# Altium project BMS_Slave.PrjPcb
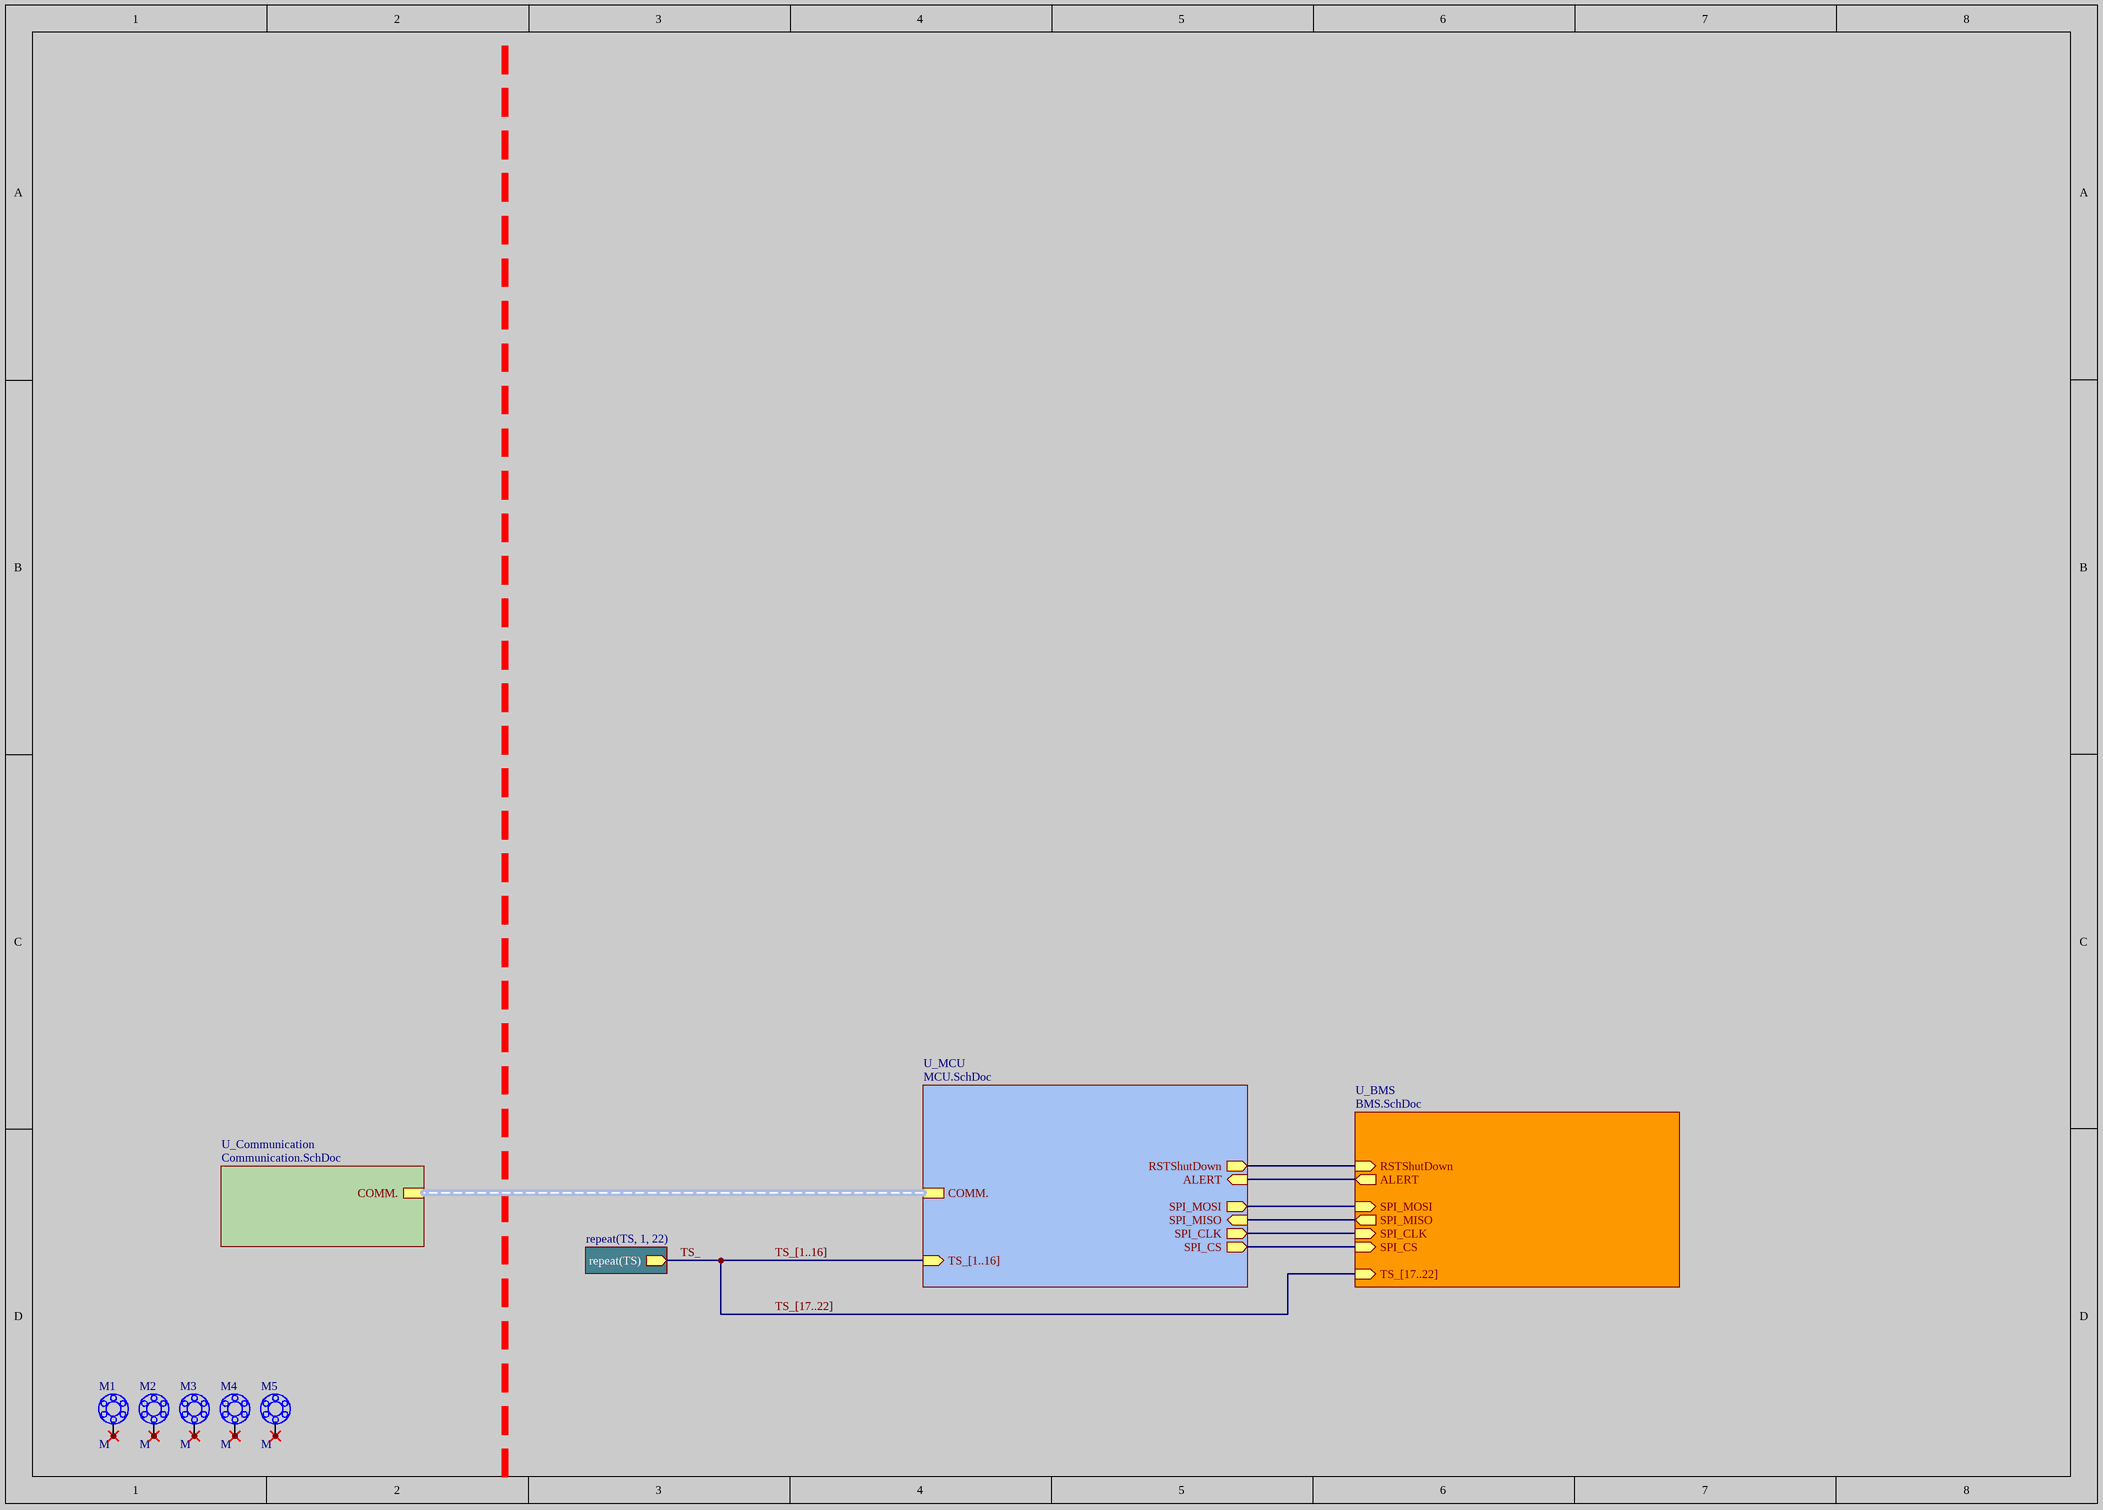
[diagram p0: MotherSheet.SchDoc]
6 sheets, 344 parts. Net scope: hierarchical (ports join the sheet entries above them; power ports are global).
Board file: BMS_Slavee.PcbDoc
Sheets:
  MotherSheet.SchDoc
    U_MCU = MCU.SchDoc
    U_Communication = Communication.SchDoc
    U_BMS = BMS.SchDoc
      balancer1 = balancer.SchDoc
      balancer2 = balancer.SchDoc
      balancer3 = balancer.SchDoc
      balancer4 = balancer.SchDoc
      balancer5 = balancer.SchDoc
      balancer6 = balancer.SchDoc
      balancer7 = balancer.SchDoc
      balancer8 = balancer.SchDoc
      balancer9 = balancer.SchDoc
      balancer10 = balancer.SchDoc
      balancer11 = balancer.SchDoc
      balancer12 = balancer.SchDoc
      balancer13 = balancer.SchDoc
      balancer14 = balancer.SchDoc
      balancer15 = balancer.SchDoc
      balancer16 = balancer.SchDoc
    TS1 = Temperature Sensors.SchDoc
    TS2 = Temperature Sensors.SchDoc
    TS3 = Temperature Sensors.SchDoc
    TS4 = Temperature Sensors.SchDoc
    TS5 = Temperature Sensors.SchDoc
    TS6 = Temperature Sensors.SchDoc
    TS7 = Temperature Sensors.SchDoc
    TS8 = Temperature Sensors.SchDoc
    TS9 = Temperature Sensors.SchDoc
    TS10 = Temperature Sensors.SchDoc
    TS11 = Temperature Sensors.SchDoc
    TS12 = Temperature Sensors.SchDoc
    TS13 = Temperature Sensors.SchDoc
    TS14 = Temperature Sensors.SchDoc
    TS15 = Temperature Sensors.SchDoc
    TS16 = Temperature Sensors.SchDoc
    TS17 = Temperature Sensors.SchDoc
    TS18 = Temperature Sensors.SchDoc
    TS19 = Temperature Sensors.SchDoc
    TS20 = Temperature Sensors.SchDoc
    TS21 = Temperature Sensors.SchDoc
    TS22 = Temperature Sensors.SchDoc

## Sheet MotherSheet.SchDoc
size A3; SheetNumber: 1; SheetTotal: 6

### Parts
M1  M  [MOUNTING]  (no BOM)
M2  M  [MOUNTING]  (no BOM)
M3  M  [MOUNTING]  (no BOM)
M4  M  [MOUNTING]  (no BOM)
M5  M  [MOUNTING]  (no BOM)

### Sub-sheets
repeat(TS, 1, 22) = Temperature Sensors.SchDoc: repeat(TS) (out)
U_BMS = BMS.SchDoc: RSTShutDown (in), SPI_CS (in), SPI_MOSI (in), SPI_MISO (out), SPI_CLK (in), ALERT (out), TS_[17..22] (in)
U_Communication = Communication.SchDoc: COMM. (harness COMM.)
U_MCU = MCU.SchDoc: COMM. (harness COMM.), SPI_CS (out), SPI_MOSI (out), SPI_MISO (in), SPI_CLK (out), ALERT (in), RSTShutDown (out), TS_[1..16] (in)

### Nets
TS_: sheet repeat(TS, 1, 22)/repeat(TS)
NetM1_1: M1.1 M1.2 M1.3 M1.4 M1.5 M1.6 M1.7
NetM2_1: M2.1 M2.2 M2.3 M2.4 M2.5 M2.6 M2.7
NetM3_1: M3.1 M3.2 M3.3 M3.4 M3.5 M3.6 M3.7
NetM4_1: M4.1 M4.2 M4.3 M4.4 M4.5 M4.6 M4.7
NetM5_1: M5.1 M5.2 M5.3 M5.4 M5.5 M5.6 M5.7
NetPB1_1: sheet U_MCU/RSTShutDown, sheet U_BMS/RSTShutDown
NetR9_2: sheet U_MCU/SPI_MISO, sheet U_BMS/SPI_MISO
NetR10_2: sheet U_MCU/SPI_CLK, sheet U_BMS/SPI_CLK
NetU1_28: sheet U_MCU/ALERT, sheet U_BMS/ALERT
NetU1_57: sheet U_MCU/SPI_MOSI, sheet U_BMS/SPI_MOSI
NetU1_61: sheet U_MCU/SPI_CS, sheet U_BMS/SPI_CS

### Buses and harness runs
bus TS_[1..16] = sheet U_MCU/TS_[1..16]
bus TS_[17..22] = sheet U_BMS/TS_[17..22]
harness sheet U_Communication/COMM. = sheet U_MCU/COMM.

### Library data of the parts
M1-M5 = MOUNTING

## Sheet MCU.SchDoc
size A3; SheetNumber: 3; SheetTotal: 6
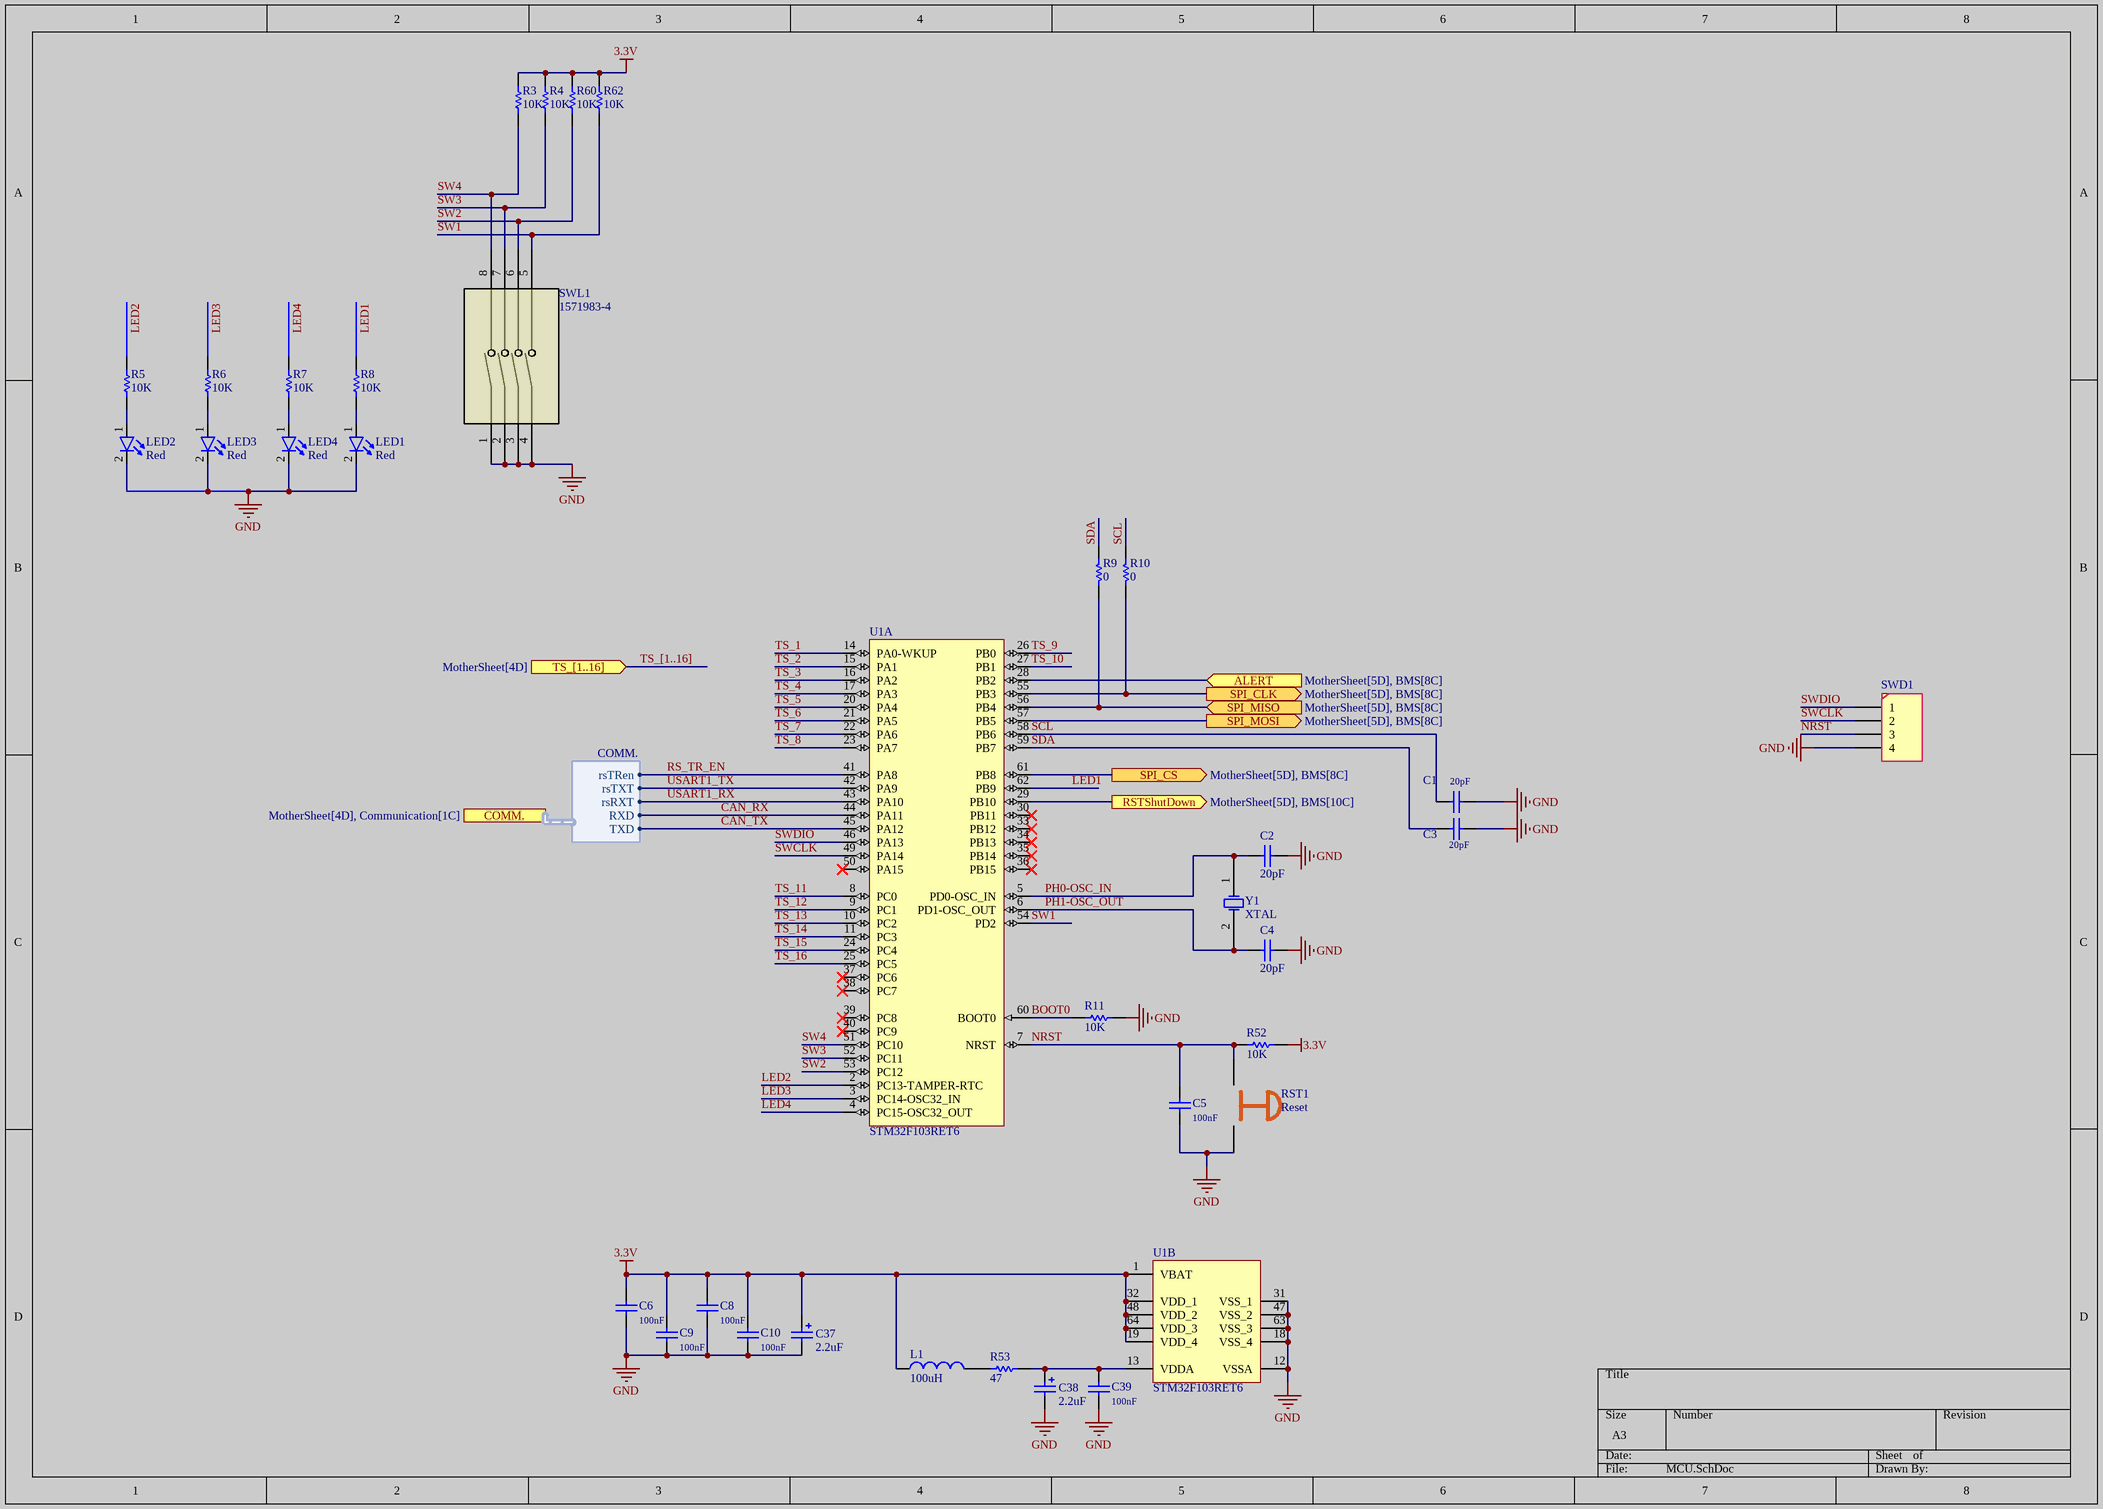
[diagram p1: MCU.SchDoc]

### Parts
C1  20pF  [CAPC0603]
C2  20pF  [CAPC0603]
C3  20pF  [CAPC0603]
C4  20pF  [CAPC0603]
C5  100nF  [CAPC0603]
C6  100nF  [CAPC0603]
C8  100nF  [CAPC0603]
C9  100nF  [CAPC0603]
C10  100nF  [CAPC0603]
C37  2.2uF  [CAP1206]
C38  2.2uF  [CAP1206]
C39  100nF  [CAPC0603]
L1  100uH  [RES1206]
LED1  Red  [LED]
LED2  Red  [LED]
LED3  Red  [LED]
LED4  Red  [LED]
R3  10K  [RES0603]
R4  10K  [RES0603]
R5  10K  [RESC0603]
R6  10K  [RESC0603]
R7  10K  [RESC0603]
R8  10K  [RESC0603]
R9  0  [RESC0603]
R10  0  [RESC0603]
R11  10K  [RESC0603]
R52  10K  [RESC0603]
R53  47  [RESC0603]
R60  10K  [RES0603]
R62  10K  [RES0603]
RST1  Reset  [SWITCH-PB4]
SWD1  (no value)  [PIN HEADER 1*4 MALE]
SWL1  1571983-4  [SW4_1571983_4P_TEC]
U1  STM32F103RET6  [LQFP, 64]  (parts A,B of 2)
Y1  XTAL  [XTAL]

### Ports
ALERT (in, see MotherSheet[5D], BMS[8C]), COMM. (harness COMM., see MotherSheet[4D], Communication[1C]), RSTShutDown (out, see MotherSheet[5D], BMS[10C]), SPI_CLK (out, see MotherSheet[5D], BMS[8C]), SPI_CS (out, see MotherSheet[5D], BMS[8C]), SPI_MISO (in, see MotherSheet[5D], BMS[8C]), SPI_MOSI (out, see MotherSheet[5D], BMS[8C]), TS_[1..16] (in, see MotherSheet[4D])

### Harnesses
COMM.: RXD, TXD, rsRXT, rsTXT, rsTRen

### Nets
3.3V: C6.1 C8.1 C9.1 C10.1 C37.1 L1.1 R3.2 R4.2 R52.2 R60.2 R62.2 U1.1(VBAT) U1.19(VDD_4) U1.32(VDD_1) U1.48(VDD_2) U1.64(VDD_3)
GND: C1.2 C2.1 C3.2 C4.1 C5.2 C6.2 C8.2 C9.2 C10.2 C37.2 C38.2 C39.2 LED1.2(K) LED2.2(K) LED3.2(K) LED4.2(K) R11.1 RST1.2 SWD1.4 SWL1.1 SWL1.2 SWL1.3 SWL1.4 U1.12(VSSA) U1.18(VSS_4) U1.31(VSS_1) U1.47(VSS_2) U1.63(VSS_3)
BOOT0: R11.2 U1.60(BOOT0)
CAN_RX: U1.44(PA11) ; port COMM..RXD
CAN_TX: U1.45(PA12) ; port COMM..TXD
LED1: R8.2 U1.62(PB9)
LED2: R5.2 U1.2(PC13-TAMPER-RTC)
LED3: R6.2 U1.3(PC14-OSC32_IN)
LED4: R7.2 U1.4(PC15-OSC32_OUT)
NRST: C5.1 R52.1 RST1.1 SWD1.3 U1.7(NRST)
PH0-OSC_IN: C2.2 U1.5(PD0-OSC_IN) Y1.1
PH1-OSC_OUT: C4.2 U1.6(PD1-OSC_OUT) Y1.2
RS_TR_EN: U1.41(PA8) ; port COMM..rsTRen
SCL: C1.1 R10.1 U1.58(PB6)
SDA: C3.1 R9.1 U1.59(PB7)
SW1: R62.1 SWL1.5 U1.54(PD2)
SW2: R60.1 SWL1.6 U1.53(PC12)
SW3: R4.1 SWL1.7 U1.52(PC11)
SW4: R3.1 SWL1.8 U1.51(PC10)
SWCLK: SWD1.2 U1.49(PA14)
SWDIO: SWD1.1 U1.46(PA13)
TS_1: U1.14(PA0-WKUP)
TS_2: U1.15(PA1)
TS_3: U1.16(PA2)
TS_4: U1.17(PA3)
TS_5: U1.20(PA4)
TS_6: U1.21(PA5)
TS_7: U1.22(PA6)
TS_8: U1.23(PA7)
TS_9: U1.26(PB0)
TS_10: U1.27(PB1)
TS_11: U1.8(PC0)
TS_12: U1.9(PC1)
TS_13: U1.10(PC2)
TS_14: U1.11(PC3)
TS_15: U1.24(PC4)
TS_16: U1.25(PC5)
USART1_RX: U1.43(PA10) ; port COMM..rsRXT
USART1_TX: U1.42(PA9) ; port COMM..rsTXT
NetC38_1: C38.1 C39.1 R53.1 U1.13(VDDA)
NetL1_2: L1.2 R53.2
NetLED1_1: LED1.1(A) R8.1
NetLED2_1: LED2.1(A) R5.1
NetLED3_1: LED3.1(A) R6.1
NetLED4_1: LED4.1(A) R7.1
NetPB1_1: U1.29(PB10) ; port RSTShutDown
NetR9_2: R9.2 U1.56(PB4) ; port SPI_MISO
NetR10_2: R10.2 U1.55(PB3) ; port SPI_CLK
NetU1_28: U1.28(PB2) ; port ALERT
NetU1_57: U1.57(PB5) ; port SPI_MOSI
NetU1_61: U1.61(PB8) ; port SPI_CS

Not connected (* = marked no-connect by the designer): U1 30(PB11)* 33(PB12)* 34(PB13)* 35(PB14)* 36(PB15)* 37(PC6)* 38(PC7)* 39(PC8)* 40(PC9)* 50(PA15)*

### Buses and harness runs
bus TS_[1..16] = port TS_[1..16]

### Library data of the parts
C1-C6 C8-C10 C39 = Capacitor: Published: 8-Jun-2000; LatestRevisionDate: 17-Jul-2002; LatestRevisionNote: Re-released for DXP Platform.; PackageReference: C0805; Publisher: Altium Limited
  C1-C4: Value: 20pF
  C5 C6 C8-C10 C39: Value: 100nF
C37 C38 = Cap_Tan: Tantalium Capacitor Size C; Published: 8-Jun-2000; LatestRevisionDate: 17-Jul-2002; LatestRevisionNote: Re-released for DXP Platform.; PackageReference: C0805; Publisher: Altium Limited
L1 = INDUCTOR: Value: 68uH; Code_IEC: 1005; Published: 8-Jun-2000; Publisher: Altium Limited; LatestRevisionDate: 17-Jul-2002; LatestRevisionNote: Re-released for DXP Platform.; PackageReference: 0402-A; Code_JEITA: 0402
LED1-LED4 = LED: Designer: Saeid Jorablo; Organazation: ControTec; Adding Date: 1387/12/22; Color: Red; Size: SMD 0603
R3-R11 R52 R53 R60 R62 = Resistor: 0603,0.1W; Published: 8-Jun-2000; LatestRevisionDate: 17-Jul-2002; LatestRevisionNote: Re-released for DXP Platform.; PackageReference: AXIAL-0.5; Publisher: Altium Limited
  R3-R8 R11 R52 R60 R62: Value: 10K
  R9 R10: Value: 0
  R53: Value: 47
RST1 = Swtich-PB4: 4-Pin Push Button
SWD1 = Header1*4: Header, 4-Pin
SWL1 = 1571983-4: GDH04S04=DIP SWITCH; Manufacturer_Name: TE Connectivity; Copyright: Copyright (C) 2025 Ultra Librarian. All rights reserved.; Manufacturer_Part_Number: 1571983-4; RefDes: RefDes; Type: Type
U1 = STM32F103RET6: ARM Cortex-M3 32-bit MCU, 512 KB Flash, 64 KB Internal RAM, 51 I/Os, 64-pin LQFP, -40 to 85 degC, Tray; A/D Converter: 3x12-bit (16 Channel); D/A Converter: 2x12-bit (2 Channel); FLASH Size (Prog) (kB): 512; I/Os (High Current): 51; Internal RAM Size (kB): 64; Operating Frequency(F) (Processor speed) (MHz): 72; Supply Voltage(Vcc) min (V): 2; DatasheetVersion: Rev. 8; PackageVersion: Rev. 4, 06/2013; PackageReference: LQFP64; PackageDescription: 64-Pin Low Profile Quad Flat Package, 10 x 10 mm Body, 0.5 mm Pitch; Supplier 1: Digi-Key; Supplier Part Number 1: 497-6444-ND; Supplier 2: Farnell; Supplier Part Number 2: 1624138; Supplier 3: Newark; Supplier Part Number 3: 01P4101; Supplier 4: Newark; Supplier Part Number 4: 57P1231; Supplier 5: Mouser; Supplier Part Number 5: 511-STM32F103RET6; Core: ARM Cortex-M3; Packing: Tray; Mounting Technology: Surface Mount; PartNumber: STM32F103RET6; ComponentLink1Description: Manufacturer URL; ComponentLink1URL: http://www.st.com/web/en/home.html; ComponentLink2Description: Datasheet; ComponentLink2URL: http://www.st.com/st-web-ui/static/active/en/resource/technical/document/datasheet/CD00191185.pdf; ComponentLink3Description: Package Specification; ComponentLink3URL: http://www.st.com/st-web-ui/static/active/en/resource/technical/document/datasheet/DM00037051.pdf

## Sheet Communication.SchDoc
size A3; SheetNumber: 2; SheetTotal: 6
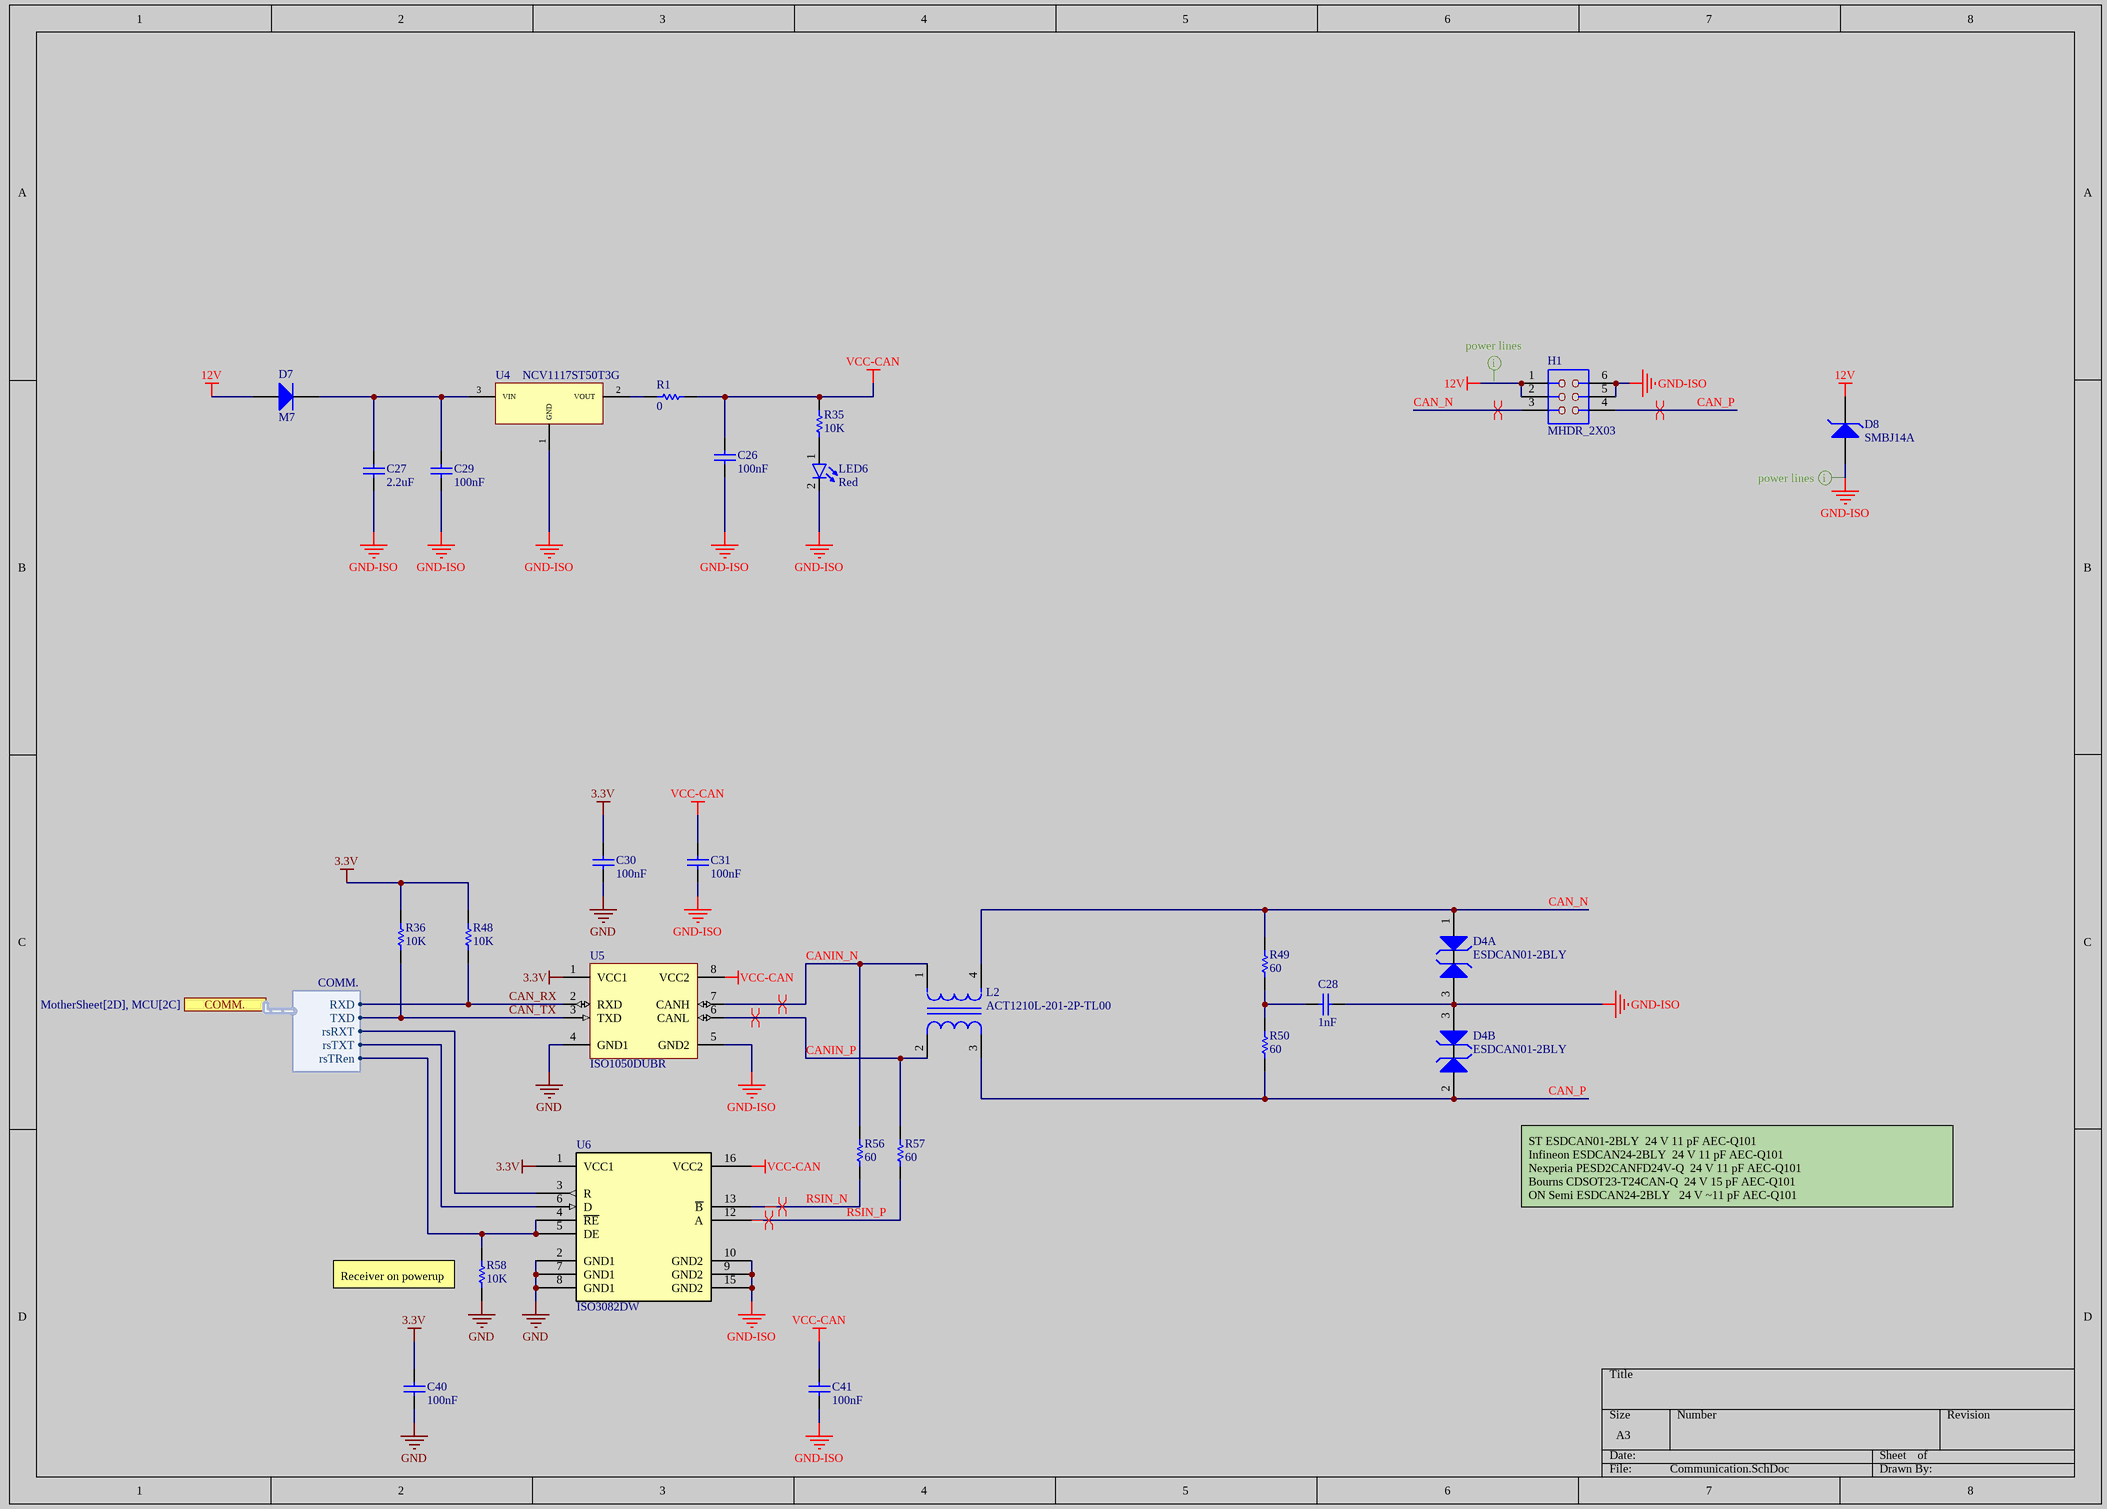
[diagram p2: Communication.SchDoc]

### Parts
C26  100nF  [CAPC0603]
C27  2.2uF  [cap1206]
C28  1nF  [CAP0603]
C29  100nF  [CAPC0603]
C30  100nF  [CAPC0603]
C31  100nF  [CAPC0603]
C40  100nF  [CAPC0603]
C41  100nF  [CAPC0603]
D4  ESDCAN01-2BLY  [NPN]  (parts A,B of 2)
D7  M7  [SS36]
D8  SMBJ14A  [SMBJSeries_LTF-M]
H1  MHDR_2X03  [miniATX 2 × 3]
L2  ACT1210L-201-2P-TL00  [FP-ACT1210L-MFG]
LED6  Red  [led]
R1  0  [RES0603]
R35  10K  [RES0603]
R36  10K  [RES0603]
R48  10K  [RES0603]
R49  60  [RES0603]
R50  60  [RES0603]
R56  60  [RES0603]
R57  60  [RES0603]
R58  10K  [RES0603]
U4  NCV1117ST50T3G  [AMS1117]
U5  ISO1050DUBR  [soic 8]
U6  ISO3082DW  [DW16]

### Ports
COMM. (harness COMM., see MotherSheet[2D], MCU[2C])

### Harnesses
COMM.: RXD, TXD, rsRXT, rsTXT, rsTRen

### Nets
3.3V: C30.2 C40.2 R36.1 R48.1 U5.1(VCC1) U6.1(VCC1)
12V: D7.1(A) D8.1(A) H1.1 H1.2
GND: C30.1 C40.1 R58.2 U5.4(GND1) U6.2(GND1) U6.7(GND1) U6.8(GND1)
GND-ISO: C26.1 C27.1 C28.1 C29.1 C31.1 C41.1 D4.3(A) D8.2(B) H1.5 H1.6 LED6.2(K) U4.1(GND) U5.5(GND2) U6.9(GND2) U6.10(GND2) U6.15(GND2)
VCC-CAN: C26.2 C31.2 C41.2 R1.2 R35.1 U5.8(VCC2) U6.16(VCC2)
CAN_N: D4.1(A) H1.3 L2.4 R49.1
CAN_P: D4.2(A) H1.4 L2.3 R50.1
CAN_RX: R48.2 U5.2(RXD) ; port COMM..RXD
CAN_TX: R36.2 U5.3(TXD) ; port COMM..TXD
CANIN_N: L2.1 R56.2 U5.7(CANH)
CANIN_P: L2.2 R57.1 U5.6(CANL)
RS_TR_EN: R58.1 U6.4(~{RE}) U6.5(DE) ; port COMM..rsTRen
RSIN_N: R56.1 U6.13(~{B})
RSIN_P: R57.2 U6.12(A)
USART1_RX: U6.3(R) ; port COMM..rsRXT
USART1_TX: U6.6(D) ; port COMM..rsTXT
NetC27_2: C27.2 C29.2 D7.2(K) U4.3(VIN)
NetC28_2: C28.2 R49.2 R50.2
NetLED6_1: LED6.1(A) R35.2
NetR1_1: R1.1 U4.2(VOUT)

### Layout directives
differential pair: CAN_N, CAN_P, CANIN_N, CANIN_P, RSIN_N, RSIN_P
rule Width Constraint [Pref Width = 1mm    Min Width = 1mm    Max Width = 1mm]; rule Routing Via Style [Pref Size = 2mm    Pref Hole Size = 1mm]; rule Routing Via Style [Pref Size = 2mm    Pref Hole Size = 1mm]: 12V, GND-ISO

### Notes on the sheet
- ST ESDCAN01-2BLY		24 V	11 pF	AEC-Q101
  Infineon ESDCAN24-2BLY		24 V	11 pF	AEC-Q101
  Nexperia PESD2CANFD24V-Q		24 V	11 pF	AEC-Q101
  Bourns CDSOT23-T24CAN-Q		24 V	15 pF	AEC-Q101
  ON Semi ESDCAN24-2BLY 		24 V	~11 pF	AEC-Q101
- (near R58) Receiver on powerup

### Library data of the parts
C26-C31 C40 C41 = Capacitor: Published: 8-Jun-2000; Publisher: Altium Limited
  C26 C29-C31 C40 C41: LatestRevisionDate: 17-Jul-2002; LatestRevisionNote: Re-released for DXP Platform.; PackageReference: C0805; Value: 100nF
  C27: LatestRevisionDate: 17-Jul-2002; LatestRevisionNote: Re-released for DXP Platform.; PackageReference: C0805; Value: 2.2uF
  C28: LatestRevisionDate: 29-May-2009; LatestRevisionNote: IPC-7351 Footprint Added.; PackageReference: C1206; PackageDescription: Chip Capacitor; Value: 1nF
D4 = TVS: transiebt voltage suppressor
D7 = SS36
D8 = SMBJ14ALK: ESD protection diode / TVS diodes
H1 = HDR_mini_2 × 3: Male Header 2X03
L2 = line filter CMP-08256-000003-1: CMC 200UH 70MA 2LN SMD; Manufacturer: TDK; Test Frequency: 100kHz; Series Resistance: 5.5Ω; Impedance At Frequency: 9.5kΩ @ 10MHz; Tolerance: -10/30%; Automotive Grade: Grade 1; Automotive: Yes; ComponentLink2URL: https://product.tdk.com/info/en/catalog/datasheets/cmf_automotive_signal_act1210l-201_en.pdf; Height: 2.5mm; RoHS: TRUE; Rms Current: 70mA; Temperature Range High: +125°C; Composition: Wirewound; Device Class L1: Passive Components; Device Class L3: Common Mode Chokes; Value: 200uH; Category: Ind; Mouser Description: Ind Common Mode Choke 200uH 9.5KOhm 70mA 5.5Ohm -10% to 30% Wirewound 4-Pin 1210; Device Class L2: EMI / RFI Components; Temperature Range Low: -40°C; Package: ACT1210L; Digikey Description: CMC 200UH 70MA 2LN SMD; Octopart: https://octopart.com/act1210l-201-2p-tl00-tdk-81014617; Manufacturer Part Number: ACT1210L-201-2P-TL00; Lead Free: Yes; Inductance: 200uH; Temperature: -40°C to +125°C; ComponentLink2Description: Datasheet
LED6 = LED: as LED1 on sheet MCU; Adding Date: 1387/12/22; Color: Red; Size: SMD 0603
R1 R35 R36 R48-R50 R56-R58 = Res: Resistor; Published: 8-Jun-2000; LatestRevisionDate: 17-Jul-2002; LatestRevisionNote: Re-released for DXP Platform.; PackageReference: AXIAL-0.3; Publisher: Altium Limited; PackageDescription: Axial Device, Thru-Hole; 2 Leads; 0.3 in Pin Spacing
  R1: Value: 0
  R35 R36 R48 R58: Value: 10K
  R49 R50 R56 R57: Value: 60
U4 = AMS1117: NCP1117ST50T3G LDO 5V
U5 = ISO1050DUBR: Isolated CAN Transceiver, -55 to 105 degC, 8-pin SOP (DUB), Green (RoHS & no Sb/Br); Manufacturer: Texas Instruments; Rating: Catalog; Isolated: Yes; Drivers Per Package: 1; PackageReference: DUB0008A; PartNumber: ISO1050DUBR; ComponentLink2Description: Package Specification; ComponentLink1Description: Datasheet; Mounting Technology: Surface Mount; ComponentLink1URL: http://www.ti.com/general/docs/lit/getliterature.tsp?genericPartNumber=ISO1050&fileType=pdf; ComponentLink2URL: http://www.ti.com/litv/pdf/mpds247b; Eco-Plan: Green (RoHS & no Sb/Br); PackageDescription: 8-Pin Small Outline Package 2.54 mm Pitch; PackageVersion: revC, May-2006; SubFamily: CAN; DatasheetVersion: SLLS983E
U6 = ISO3082DW: 200-Kbps, half-duplex, 2.5-kVrms isolated RS-485 & RS-422 transceiver 16-SOIC -40 to 85; Manufacturer_Name: Texas Instruments; Copyright: Copyright (C) 2025 Ultra Librarian. All rights reserved.; Manufacturer_Part_Number: ISO3082DW; RefDes: RefDes; Type: Type

## Sheet BMS.SchDoc
size A1; SheetNumber: 5; SheetTotal: 6
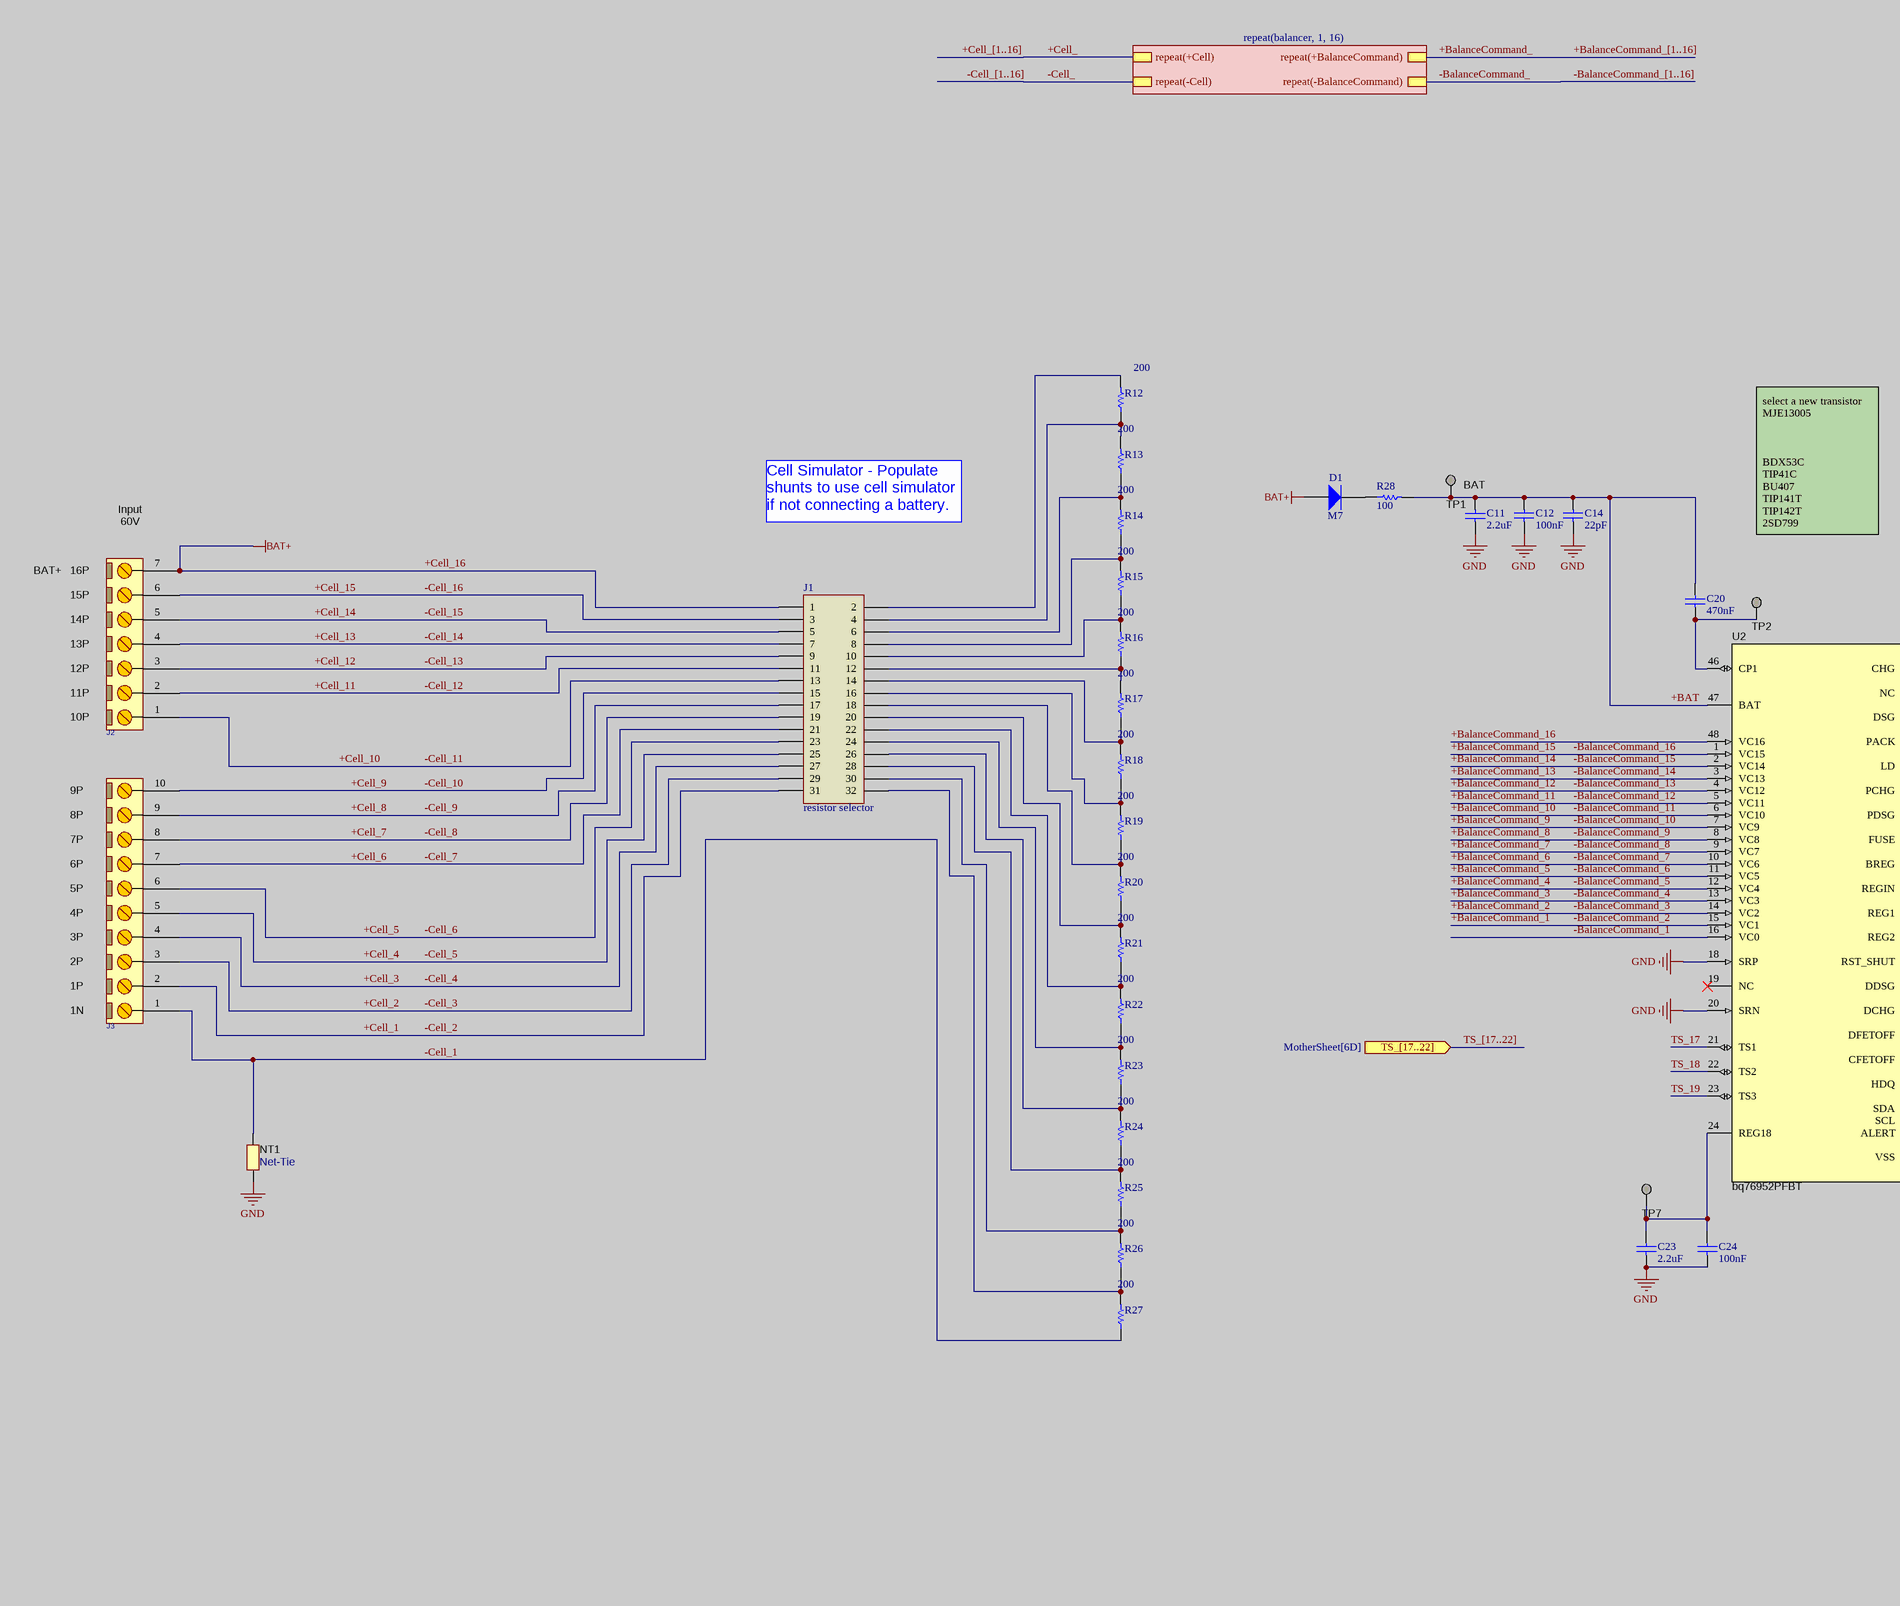
[diagram p3: BMS.SchDoc, left]
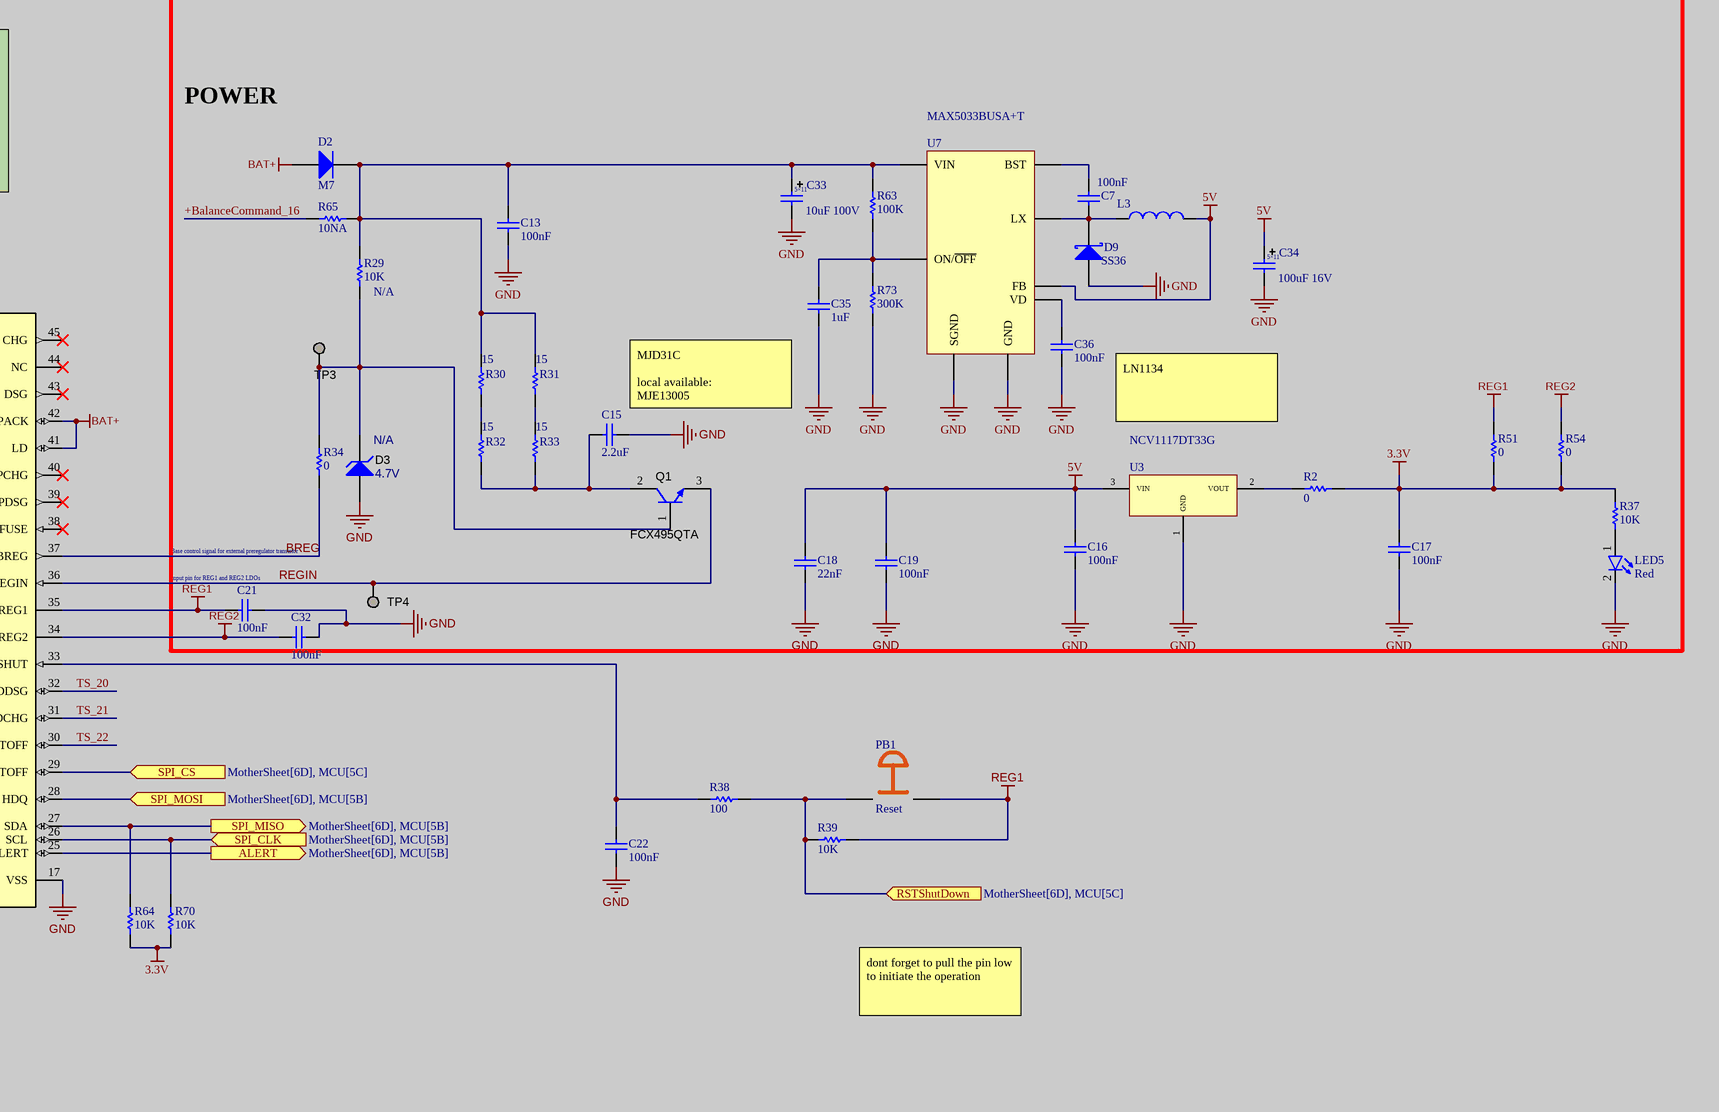
[diagram p4: BMS.SchDoc, right]

### Parts
C7  100nF  [CAPC0603]
C11  2.2uF  [cap1206]
C12  100nF  [CAPC0603]
C13  100nF  [CAPC0603]
C14  22pF  [CAPC0603]
C15  2.2uF  [cap1206]
C16  100nF  [CAPC0603]
C17  100nF  [CAPC0603]
C18  22nF  [CAPC0603]
C19  100nF  [CAPC0603]
C20  470nF  [cap1206]
C21  100nF  [CAPC0603]
C22  100nF  [CAPC0603]
C23  2.2uF  [cap1206]
C24  100nF  [CAPC0603]
C32  100nF  [CAPC0603]
C33  10uF 100V  [CAP 5*11]
C34  100uF 16V  [CAP 5*11]
C35  1uF  [CAPC0603]
C36  100nF  [CAPC0603]
D1  M7  [SS36]
D2  M7  [SS36]
D3  N/A  value 4.7V  [ZENER]
D9  SS36  [SS36]
J1  resistor selector  [SULLINS_PEC10DAAN]
J2  CONN_TB8  [pheonix_7]  (value not drawn)
J3  CONN_TB8  [pheonix_10]  (value not drawn)
L3  22uH  [INDUCTOR 7*7]  (value not drawn)
LED5  Red  [led]
NT1  Net-Tie  [Net-Tie_10milWide_30milLong]  (net tie, no BOM)
PB1  Reset  [SWITCH-PB4]
Q1  FCX495QTA  [sot-89]
R2  0  [RES0603]
R12  200  [RESC0603]
R13  200  [RESC0603]
R14  200  [RESC0603]
R15  200  [RESC0603]
R16  200  [RESC0603]
R17  200  [RESC0603]
R18  200  [RESC0603]
R19  200  [RESC0603]
R20  200  [RESC0603]
R21  200  [RESC0603]
R22  200  [RESC0603]
R23  200  [RESC0603]
R24  200  [RESC0603]
R25  200  [RESC0603]
R26  200  [RESC0603]
R27  200  [RESC0603]
R28  100  [RESC0603]
R29  N/A  value 10K  [RES0603]
R30  15  [RES2512]
R31  15  [RES2512]
R32  15  [RES2512]
R33  15  [RES2512]
R34  0  [RES0603]
R37  10K  [RES0603]
R38  100  [RES0603]
R39  10K  [RES0603]
R51  0  [RES0603]
R54  0  [RES0603]
R63  100K  [RESC0603]
R64  10K  [RES0603]
R65  10NA  [RES0603]
R70  10K  [RES0603]
R73  300K  [RESC0603]
TP1  TESTPOINT  [Test Point]  (value not drawn)  (no BOM)
TP2  TESTPOINT  [Test Point]  (value not drawn)  (no BOM)
TP3  TESTPOINT  [Test Point]  (value not drawn)  (no BOM)
TP4  TESTPOINT  [Test Point]  (value not drawn)  (no BOM)
TP7  TESTPOINT  [Test Point]  (value not drawn)  (no BOM)
U2  bq76952PFBT  [STM32F103C8T6]
U3  NCV1117DT33G  [AMS1117]
U7  MAX5033BUSA+T  [SOIC8]

### Blocks framed on the sheet
POWER: C7 C13 C15-C19 C21 C32-C36 D2 D3 D9 L3 LED5 Q1 R2 R29-R34 R37 R51 R54 R63 R65 R73 TP3 TP4 U3 U7

### Sub-sheets
repeat(balancer, 1, 16) = balancer.SchDoc: repeat(+Cell), repeat(+BalanceCommand), repeat(-Cell), repeat(-BalanceCommand)

### Ports
ALERT (out, see MotherSheet[6D], MCU[5B]), RSTShutDown (in, see MotherSheet[6D], MCU[5C]), SPI_CLK (in, see MotherSheet[6D], MCU[5B]), SPI_CS (in, see MotherSheet[6D], MCU[5C]), SPI_MISO (out, see MotherSheet[6D], MCU[5B]), SPI_MOSI (in, see MotherSheet[6D], MCU[5B]), TS_[17..22] (in, see MotherSheet[6D])

### Nets
3.3V: C17.2 R2.2 R37.1 R51.1 R54.1 R64.2 R70.2
5V: C16.2 C18.2 C19.2 C34.2 L3.2 U3.3(VIN) U7.4(FB)
+Cell_16: D1.1(A) D2.1(A) J1.1 J2.7 U2.41(LD) U2.42(PACK)  [also labelled BAT+]
GND: C11.2 C12.1 C13.1 C14.1 C15.1 C16.1 C17.1 C18.1 C19.1 C21.2 C22.1 C23.1 C24.1 C32.2 C33.1 C34.1 C35.1 C36.1 D3.2(A) D9.1(A) LED5.2(K) NT1.2 R73.1 U2.17(VSS) U2.18(SRP) U2.20(SRN) U3.1(GND) U7.3(SGND) U7.6(GND)
REG1: C21.1 PB1.2 R39.2 R51.2 U2.35(REG1)
REG2: C32.1 R54.2 U2.34(REG2)
+BalanceCommand_: sheet repeat(balancer, 1, 16)/repeat(+BalanceCommand)
+BalanceCommand_1: U2.15(VC1)  [also labelled -BalanceCommand_2]
+BalanceCommand_2: U2.14(VC2)  [also labelled -BalanceCommand_3]
+BalanceCommand_3: U2.13(VC3)  [also labelled -BalanceCommand_4]
+BalanceCommand_4: U2.12(VC4)  [also labelled -BalanceCommand_5]
+BalanceCommand_5: U2.11(VC5)  [also labelled -BalanceCommand_6]
+BalanceCommand_6: U2.10(VC6)  [also labelled -BalanceCommand_7]
+BalanceCommand_7: U2.9(VC7)  [also labelled -BalanceCommand_8]
+BalanceCommand_8: U2.8(VC8)  [also labelled -BalanceCommand_9]
+BalanceCommand_9: U2.7(VC9)  [also labelled -BalanceCommand_10]
+BalanceCommand_10: U2.6(VC10)  [also labelled -BalanceCommand_11]
+BalanceCommand_11: U2.5(VC11)  [also labelled -BalanceCommand_12]
+BalanceCommand_12: U2.4(VC12)  [also labelled -BalanceCommand_13]
+BalanceCommand_13: U2.3(VC13)  [also labelled -BalanceCommand_14]
+BalanceCommand_14: U2.2(VC14)  [also labelled -BalanceCommand_15]
+BalanceCommand_15: U2.1(VC15)  [also labelled -BalanceCommand_16]
+BalanceCommand_16: R65.1 U2.48(VC16)
+BAT: C11.1 C12.2 C14.2 C20.1 R28.2 TP1.1 U2.47(BAT)
+Cell_: sheet repeat(balancer, 1, 16)/repeat(+Cell)
+Cell_1: J1.31 J3.2  [also labelled -Cell_2]
+Cell_2: J1.29 J3.3  [also labelled -Cell_3]
+Cell_3: J1.27 J3.4  [also labelled -Cell_4]
+Cell_4: J1.25 J3.5  [also labelled -Cell_5]
+Cell_5: J1.23 J3.6  [also labelled -Cell_6]
+Cell_6: J1.21 J3.7  [also labelled -Cell_7]
+Cell_7: J1.19 J3.8  [also labelled -Cell_8]
+Cell_8: J1.17 J3.9  [also labelled -Cell_9]
+Cell_9: J1.15 J3.10  [also labelled -Cell_10]
+Cell_10: J1.13 J2.1  [also labelled -Cell_11]
+Cell_11: J1.11 J2.2  [also labelled -Cell_12]
+Cell_12: J1.9 J2.3  [also labelled -Cell_13]
+Cell_13: J1.7 J2.4  [also labelled -Cell_14]
+Cell_14: J1.5 J2.5  [also labelled -Cell_15]
+Cell_15: J1.3 J2.6  [also labelled -Cell_16]
-BalanceCommand_: sheet repeat(balancer, 1, 16)/repeat(-BalanceCommand)
-BalanceCommand_1: U2.16(VC0)
-Cell_: sheet repeat(balancer, 1, 16)/repeat(-Cell)
-Cell_1: J3.1 NT1.1 R27.1
BREG: R34.2 U2.37(BREG)
REGIN: Q1.3(E) TP4.1 U2.36(REGIN)
TS_17: U2.21(TS1)
TS_18: U2.22(TS2)
TS_19: U2.23(TS3)
TS_20: U2.32(DDSG)
TS_21: U2.31(DCHG)
TS_22: U2.30(DFETOFF)
NetC7_1: C7.1 D9.2(K) L3.1 U7.8(LX)
NetC7_2: C7.2 U7.1(BST)
NetC13_2: C13.2 C33.2 D2.2(K) R29.1 R30.2 R31.2 R63.2 R65.2 U7.7(VIN)
NetC15_2: C15.2 Q1.2(C) R32.1 R33.1
NetC20_2: C20.2 TP2.1 U2.46(CP1)
NetC22_2: C22.2 R38.1 U2.33(RST_SHUT)
NetC23_2: C23.2 C24.2 TP7.1 U2.24(REG18)
NetC35_2: C35.2 R63.1 R73.2 U7.5(ON/~{OFF})
NetC36_2: C36.2 U7.2(VD)
NetD1_2: D1.2(K) R28.1
NetD3_1: D3.1(K) Q1.1(B) R29.2 R34.1 TP3.1
NetJ1_2: J1.2 R12.2
NetJ1_4: J1.4 R12.1 R13.2
NetJ1_6: J1.6 R13.1 R14.2
NetJ1_8: J1.8 R14.1 R15.2
NetJ1_10: J1.10 R15.1 R16.2
NetJ1_12: J1.12 R16.1 R17.2
NetJ1_14: J1.14 R17.1 R18.2
NetJ1_16: J1.16 R18.1 R19.2
NetJ1_18: J1.18 R19.1 R20.2
NetJ1_20: J1.20 R20.1 R21.2
NetJ1_22: J1.22 R21.1 R22.2
NetJ1_24: J1.24 R22.1 R23.2
NetJ1_26: J1.26 R23.1 R24.2
NetJ1_28: J1.28 R24.1 R25.2
NetJ1_30: J1.30 R25.1 R26.2
NetJ1_32: J1.32 R26.1 R27.2
NetLED5_1: LED5.1(A) R37.2
NetPB1_1: PB1.1 R38.2 R39.1 ; port RSTShutDown
NetR2_1: R2.1 U3.2(VOUT)
NetR9_2: R64.1 U2.27(SDA) ; port SPI_MISO
NetR10_2: R70.1 U2.26(SCL) ; port SPI_CLK
NetR30_1: R30.1 R32.2
NetR31_1: R31.1 R33.2
NetU1_28: U2.25(ALERT) ; port ALERT
NetU1_57: U2.28(HDQ) ; port SPI_MOSI
NetU1_61: U2.29(CFETOFF) ; port SPI_CS

Not connected (* = marked no-connect by the designer): U2 19(NC)* 38(FUSE)* 39(PDSG)* 40(PCHG)* 43(DSG)* 44(NC)* 45(CHG)*

### Buses and harness runs
bus +BalanceCommand_[1..16]
bus +Cell_[1..16]
bus -BalanceCommand_[1..16]
bus -Cell_[1..16]
bus TS_[17..22] = port TS_[17..22]

### Notes on the sheet
- Input
- (near J2) 60V
- Cell Simulator - Populate shunts to use cell simulator if not connecting a battery.
- BAT
- BAT+
- 16P
- select a new transistor
  MJE13005
  BDX53C
  TIP41C
  BU407
  TIP141T
  TIP142T
  2SD799
- 13P
- 15P
- 14P
- 12P
- 11P
- 10P
- MJD31C
  local available:
  MJE13005
- LN1134
- 8P
- 9P
- 6P
- 5P
- 7P
- (near C21) Input pin for REG1 and REG2 LDOs
- Base control signal for external preregulator transistor
- 4P
- 3P
- 2P
- 1P
- 1N
- dont forget to pull the pin low to initiate the operation
- (in symbol CAP 5*11) 5×11

### Library data of the parts
C7 C36 = Capacitor: 100nF-0603; Published: 8-Jun-2000; LatestRevisionDate: 17-Jul-2002; LatestRevisionNote: Re-released for DXP Platform.; PackageReference: C0805; Publisher: Altium Limited; Value: 100nF
C11-C24 C32 = Capacitor: Published: 8-Jun-2000; LatestRevisionDate: 17-Jul-2002; LatestRevisionNote: Re-released for DXP Platform.; PackageReference: C0805; Publisher: Altium Limited
  C11 C15 C23: Value: 2.2uF
  C12 C13 C16 C17 C19 C21 C22 C24 C32: Value: 100nF
  C14: Value: 22pF
  C18: Value: 22nF
  C20: Value: 470nF
C33 C34 = CAP 5*11
C35 = Capacitor: 1uF-0603; Published: 8-Jun-2000; LatestRevisionDate: 17-Jul-2002; LatestRevisionNote: Re-released for DXP Platform.; PackageReference: C0805; Publisher: Altium Limited; Value: 1uF
D1 D2 = SS36
D3 = CMP-0005740-3: Diode, Zener, 4.7 V, 500 mW; Manufacturer: ON Semiconductor; PartNumber: MMSZ4697T1G; SizeY_mm: 1.7; SizeX_mm: 3.85; RJA_CperW: 340; SizeAreaWB_mm2: 13.095; AEC Category: Q101; Power_W: 500mW; SizeZ_mm: 1.35; Vz_V: 10V; Value1: 0.5W; SizeArea_mm2: 6.545; PackageReference: SOD-123; AEC Qualified: ?; MountType: SMT; RoHS: Y; ComponentLink1Description: Datasheet link; CompType: Zener; ComponentLink1URL: http://www.onsemi.com/pub_link/Collateral/MMSZ4678T1-D.PDF
D9 = SS34: SS36 -Jled; Published: 8-Jun-2000; LatestRevisionDate: 17-Jul-2002; LatestRevisionNote: Re-released for DXP Platform.; PackageReference: SMB; Publisher: Altium Limited; Code_JEDEC: DO-214-AA
J1 = Header 2*16 LED: Header 2*16 LED 2mm
J2 = CONN_TB7: CONN, TERMINAL BLOCK, 5.08mm pitch; VALUE: CONN_TB8
J3 = CONN_TB10: CONN, TERMINAL BLOCK, 5.08mm pitch; VALUE: CONN_TB8
L3 = INDUCTOR 7*7
LED5 = LED: as LED1 on sheet MCU; Adding Date: 1387/12/22; Color: Red; Size: SMD 0603
NT1 = Net-Tie: Single point connection between nets.; MountType: SMT; PackageReference: N/A; CompType: Net-Tie; Manufacturer: N/A; PartNumber: N/A
PB1 = Swtich-PB4: 4-Pin Push Button
Q1 = BSR14, Nexperia: BJT 30V 3A 40V 10W SI-NPN; PartNumber: BSR14; U/M: EA; Value1: 0.8 A; Value2: 300; SizeAreaWB_mm2: 14; SizeArea_mm2: 7.5; SizeX_mm: 2.5; SizeY_mm: 3; SizeZ_mm: 1.1; AEC Category: Q101; PNP: 0; NPN: 1; Vceo_V: 40; Vcesat1_V: 0.3; IcRated_A: 0.8; TaMin_C: -65; TaMax_C: 150; SymbolVersion: 2008-07-31; CompType: BJT; Manufacturer: Nexperia; PackageReference: SOT-23; Value: 40 V; RoHS: Y; MountType: SMT; Published: 2008-07-31; Publisher: Texas Instruments; LatestRevisionDate: 2017-06-09; ComponentLink1Description: Datasheet link; ComponentLink1URL: http://www.nexperia.com/documents/data_sheet/BSR13_BSR14.pdf; Supplier 1: Digi-Key; Supplier Part Number 1: 568-6225-1-ND; AEC Qualified: ?; HfeMax: 300
R2 R29 R34 R37-R39 R51 R54 R64 R65 R70 = Res: Resistor; Published: 8-Jun-2000; LatestRevisionDate: 17-Jul-2002; LatestRevisionNote: Re-released for DXP Platform.; PackageReference: AXIAL-0.3; Publisher: Altium Limited; PackageDescription: Axial Device, Thru-Hole; 2 Leads; 0.3 in Pin Spacing
  R2 R34 R51 R54: Value: 0
  R37 R39 R64 R70: Value: 10K
  R38: Value: 100
  R65: Value: 10NA
R12-R28 = Resistor: 0603,0.1W; PackageReference: AXIAL-0.5; Published: 8-Jun-2000; LatestRevisionDate: 17-Jul-2002; LatestRevisionNote: Re-released for DXP Platform.; Publisher: Altium Limited
  R12-R27: Value: 200
  R28: Value: 100
R30-R33 = Resistor_2: 0603,0.1W; Value: 15; PackageReference: AXIAL-0.5; Published: 8-Jun-2000; LatestRevisionDate: 17-Jul-2002; LatestRevisionNote: Re-released for DXP Platform.; Publisher: Altium Limited
R63 = Resistor: 100K-0603; Value: 866K; Published: 8-Jun-2000; LatestRevisionDate: 17-Jul-2002; LatestRevisionNote: Re-released for DXP Platform.; PackageReference: AXIAL-0.5; Publisher: Altium Limited
R73 = Resistor: 300K-0603; Value: 2.5M; Published: 8-Jun-2000; LatestRevisionDate: 17-Jul-2002; LatestRevisionNote: Re-released for DXP Platform.; PackageReference: AXIAL-0.5; Publisher: Altium Limited
TP1-TP4 TP7 = TESTPOINT: TEST POINT.  No entry in BOM.; PartNumber: N/A; CompType: Testpoint; Manufacturer: N/A; PackageReference: N/A
U2 = bq76952: Multicell Battery Monitor and Protection Family, PFB0048A (TQFP-48); Alternate PartNumber: bq76952PFBR; Alternate Manufacturer: Texas Instruments; SizeAreaWB_mm2: 121; SizeZ_mm: 1.2; SizeX_mm: 9; SizeArea_mm2: 81; CompType: IC; AEC Qualified: N; AEC Category: Q200; ComponentLink1URL: http://www.ti.com/lit/ds/symlink/bq76952.pdf; PackageDescription: TQFP-48; MountType: SMT; ComponentLink2URL: http://www.ti.com/product/bq76952; ComponentLink3Description: Online Datasheet; ComponentLink2Description: Product Folder; Manufacturer: Texas Instruments; ComponentLink3URL: http://www.ti.com/product/bq76952/datasheet; PackageReference: PFB0048A; SizeY_mm: 9; PartNumber: bq76952PFBT; ComponentLink1Description: Datasheet Link
U3 = AMS1117: High Accuracy, Ultralow IQ, 1.5 A, anyCAP Low Dropout Regulator
U7 = MAX5033: High-Efficiency, MAXPower    Step-Down DC-DC Converter

## Sheet balancer.SchDoc
size A4; SheetNumber: 6; SheetTotal: 6
Used 16 times, as channels U_BMS/balancer1, U_BMS/balancer2, U_BMS/balancer3, U_BMS/balancer4, U_BMS/balancer5, U_BMS/balancer6, U_BMS/balancer7, U_BMS/balancer8, U_BMS/balancer9, U_BMS/balancer10, U_BMS/balancer11, U_BMS/balancer12, U_BMS/balancer13, U_BMS/balancer14, U_BMS/balancer15, U_BMS/balancer16. Parts and nets are listed once, with the designators drawn on the sheet.
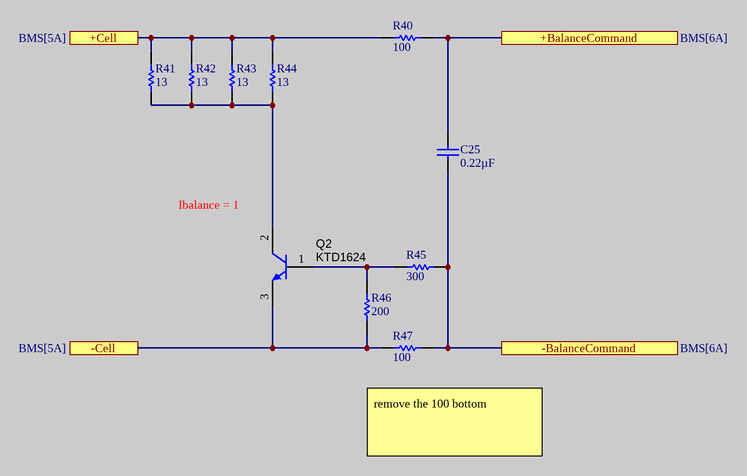
[diagram p5: balancer.SchDoc]

### Parts
C25  0.22µF  [CAPC0603]
Q2  KTD1624  [sot-89]
R40  100  [RESC0603]
R41  13  [RES2512]
R42  13  [RES2512]
R43  13  [RES2512]
R44  13  [RES2512]
R45  300  [RESC0603]
R46  200  [RESC0603]
R47  100  [RESC0603]

### Ports
+BalanceCommand (see BMS[6A]), +Cell (see BMS[5A]), -BalanceCommand (see BMS[6A]), -Cell (see BMS[5A])

### Nets
+BalanceCommand: C25.2 R40.2 ; port +BalanceCommand
+Cell: R40.1 R41.1 R42.1 R43.1 R44.1 ; port +Cell
-BalanceCommand: C25.1 R45.2 R47.2 ; port -BalanceCommand
-Cell: Q2.3(E) R46.1 R47.1 ; port -Cell
NetQ2_1: Q2.1(B) R45.1 R46.2
NetQ2_2: Q2.2(C) R41.2 R42.2 R43.2 R44.2

### Channels
U_BMS/balancer1: designators end in _1; ports +BalanceCommand=+BalanceCommand_1 +Cell=+Cell_1 -BalanceCommand=-BalanceCommand_1 -Cell=-Cell_1
U_BMS/balancer2: designators end in _2; ports +BalanceCommand=+BalanceCommand_2 +Cell=+Cell_2 -BalanceCommand=+BalanceCommand_1 -Cell=+Cell_1
U_BMS/balancer3: designators end in _3; ports +BalanceCommand=+BalanceCommand_3 +Cell=+Cell_3 -BalanceCommand=+BalanceCommand_2 -Cell=+Cell_2
U_BMS/balancer4: designators end in _4; ports +BalanceCommand=+BalanceCommand_4 +Cell=+Cell_4 -BalanceCommand=+BalanceCommand_3 -Cell=+Cell_3
U_BMS/balancer5: designators end in _5; ports +BalanceCommand=+BalanceCommand_5 +Cell=+Cell_5 -BalanceCommand=+BalanceCommand_4 -Cell=+Cell_4
U_BMS/balancer6: designators end in _6; ports +BalanceCommand=+BalanceCommand_6 +Cell=+Cell_6 -BalanceCommand=+BalanceCommand_5 -Cell=+Cell_5
U_BMS/balancer7: designators end in _7; ports +BalanceCommand=+BalanceCommand_7 +Cell=+Cell_7 -BalanceCommand=+BalanceCommand_6 -Cell=+Cell_6
U_BMS/balancer8: designators end in _8; ports +BalanceCommand=+BalanceCommand_8 +Cell=+Cell_8 -BalanceCommand=+BalanceCommand_7 -Cell=+Cell_7
U_BMS/balancer9: designators end in _9; ports +BalanceCommand=+BalanceCommand_9 +Cell=+Cell_9 -BalanceCommand=+BalanceCommand_8 -Cell=+Cell_8
U_BMS/balancer10: designators end in _10; ports +BalanceCommand=+BalanceCommand_10 +Cell=+Cell_10 -BalanceCommand=+BalanceCommand_9 -Cell=+Cell_9
U_BMS/balancer11: designators end in _11; ports +BalanceCommand=+BalanceCommand_11 +Cell=+Cell_11 -BalanceCommand=+BalanceCommand_10 -Cell=+Cell_10
U_BMS/balancer12: designators end in _12; ports +BalanceCommand=+BalanceCommand_12 +Cell=+Cell_12 -BalanceCommand=+BalanceCommand_11 -Cell=+Cell_11
U_BMS/balancer13: designators end in _13; ports +BalanceCommand=+BalanceCommand_13 +Cell=+Cell_13 -BalanceCommand=+BalanceCommand_12 -Cell=+Cell_12
U_BMS/balancer14: designators end in _14; ports +BalanceCommand=+BalanceCommand_14 +Cell=+Cell_14 -BalanceCommand=+BalanceCommand_13 -Cell=+Cell_13
U_BMS/balancer15: designators end in _15; ports +BalanceCommand=+BalanceCommand_15 +Cell=+Cell_15 -BalanceCommand=+BalanceCommand_14 -Cell=+Cell_14
U_BMS/balancer16: designators end in _16; ports +BalanceCommand=+BalanceCommand_16 +Cell=+Cell_16 -BalanceCommand=+BalanceCommand_15 -Cell=+Cell_15

### Notes on the sheet
- (near Q2) Ibalance = 1
- (near R47) remove the 100 bottom

### Library data of the parts
C25 = Capacitor: Published: 8-Jun-2000; LatestRevisionDate: 17-Jul-2002; LatestRevisionNote: Re-released for DXP Platform.; PackageReference: C0805; Publisher: Altium Limited; Value: 0.22µF
Q2 = BSR14, Nexperia: as Q1 on sheet BMS; SymbolVersion: 2008-07-31; CompType: BJT; Manufacturer: Nexperia; PackageReference: SOT-23; Value: 40 V; RoHS: Y; MountType: SMT; Published: 2008-07-31; Publisher: Texas Instruments; LatestRevisionDate: 2017-06-09; ComponentLink1Description: Datasheet link; ComponentLink1URL: http://www.nexperia.com/documents/data_sheet/BSR13_BSR14.pdf; Supplier 1: Digi-Key; Supplier Part Number 1: 568-6225-1-ND; AEC Qualified: ?; HfeMax: 300
R40-R47 = Resistor: 0603,0.1W; Published: 8-Jun-2000; LatestRevisionDate: 17-Jul-2002; LatestRevisionNote: Re-released for DXP Platform.; PackageReference: AXIAL-0.5; Publisher: Altium Limited
  R40 R47: Value: 100
  R41-R44: Value: 13
  R45: Value: 300
  R46: Value: 200

## Sheet Temperature Sensors.SchDoc
size A4; SheetNumber: 4; SheetTotal: 6
Used 22 times, as channels TS1, TS2, TS3, TS4, TS5, TS6, TS7, TS8, TS9, TS10, TS11, TS12, TS13, TS14, TS15, TS16, TS17, TS18, TS19, TS20, TS21, TS22. Parts and nets are listed once, with the designators drawn on the sheet.
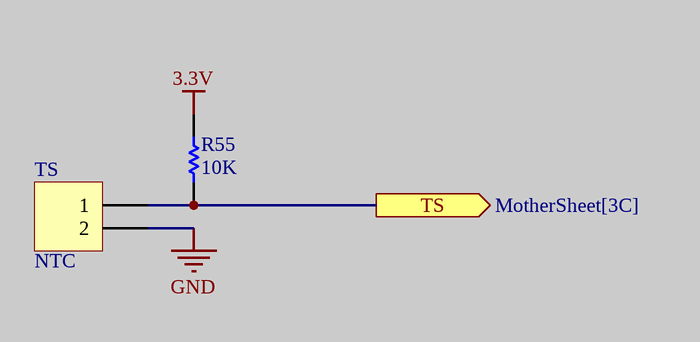
[diagram p6: Temperature Sensors.SchDoc]

### Parts
R55  10K  [RESC0603]
TS  NTC  [HEADER1*2 xn]

### Ports
TS (out, see MotherSheet[3C])

### Nets
3.3V: R55.2
GND: TS.2
TS: R55.1 TS.1 ; port TS

### Channels
TS1: designators end in _1; ports TS=TS_1
TS2: designators end in _2; ports TS=TS_2
TS3: designators end in _3; ports TS=TS_3
TS4: designators end in _4; ports TS=TS_4
TS5: designators end in _5; ports TS=TS_5
TS6: designators end in _6; ports TS=TS_6
TS7: designators end in _7; ports TS=TS_7
TS8: designators end in _8; ports TS=TS_8
TS9: designators end in _9; ports TS=TS_9
TS10: designators end in _10; ports TS=TS_10
TS11: designators end in _11; ports TS=TS_11
TS12: designators end in _12; ports TS=TS_12
TS13: designators end in _13; ports TS=TS_13
TS14: designators end in _14; ports TS=TS_14
TS15: designators end in _15; ports TS=TS_15
TS16: designators end in _16; ports TS=TS_16
TS17: designators end in _17; ports TS=TS_17
TS18: designators end in _18; ports TS=TS_18
TS19: designators end in _19; ports TS=TS_19
TS20: designators end in _20; ports TS=TS_20
TS21: designators end in _21; ports TS=TS_21
TS22: designators end in _22; ports TS=TS_22

### Library data of the parts
R55 = Resistor: 0603,0.1W; Published: 8-Jun-2000; LatestRevisionDate: 17-Jul-2002; LatestRevisionNote: Re-released for DXP Platform.; PackageReference: AXIAL-0.5; Publisher: Altium Limited; Value: 10K
TS = Header1*2 XN: Header, 2-Pin XN

## Nets that join several sheets
3.3V: MCU (16 pins), Communication (6 pins), BMS (7 pins), TS1 (R55_1.2), TS2 (R55_2.2), TS3 (R55_3.2), TS4 (R55_4.2), TS5 (R55_5.2), TS6 (R55_6.2), TS7 (R55_7.2), TS8 (R55_8.2), TS9 (R55_9.2), TS10 (R55_10.2), TS11 (R55_11.2), TS12 (R55_12.2), TS13 (R55_13.2), TS14 (R55_14.2), TS15 (R55_15.2), TS16 (R55_16.2), TS17 (R55_17.2), TS18 (R55_18.2), TS19 (R55_19.2), TS20 (R55_20.2), TS21 (R55_21.2), TS22 (R55_22.2)
+Cell_16: BMS (6 pins), U_BMS/balancer16 (5 pins)
GND: MCU (28 pins), Communication (7 pins), BMS (29 pins), TS1 (TS_1.2), TS2 (TS_2.2), TS3 (TS_3.2), TS4 (TS_4.2), TS5 (TS_5.2), TS6 (TS_6.2), TS7 (TS_7.2), TS8 (TS_8.2), TS9 (TS_9.2), TS10 (TS_10.2), TS11 (TS_11.2), TS12 (TS_12.2), TS13 (TS_13.2), TS14 (TS_14.2), TS15 (TS_15.2), TS16 (TS_16.2), TS17 (TS_17.2), TS18 (TS_18.2), TS19 (TS_19.2), TS20 (TS_20.2), TS21 (TS_21.2), TS22 (TS_22.2)
+BalanceCommand_1: BMS (U2.15), U_BMS/balancer1 (C25_1.2 R40_1.2), U_BMS/balancer2 (C25_2.1 R45_2.2 R47_2.2)
+BalanceCommand_2: BMS (U2.14), U_BMS/balancer2 (C25_2.2 R40_2.2), U_BMS/balancer3 (C25_3.1 R45_3.2 R47_3.2)
+BalanceCommand_3: BMS (U2.13), U_BMS/balancer3 (C25_3.2 R40_3.2), U_BMS/balancer4 (C25_4.1 R45_4.2 R47_4.2)
+BalanceCommand_4: BMS (U2.12), U_BMS/balancer4 (C25_4.2 R40_4.2), U_BMS/balancer5 (C25_5.1 R45_5.2 R47_5.2)
+BalanceCommand_5: BMS (U2.11), U_BMS/balancer5 (C25_5.2 R40_5.2), U_BMS/balancer6 (C25_6.1 R45_6.2 R47_6.2)
+BalanceCommand_6: BMS (U2.10), U_BMS/balancer6 (C25_6.2 R40_6.2), U_BMS/balancer7 (C25_7.1 R45_7.2 R47_7.2)
+BalanceCommand_7: BMS (U2.9), U_BMS/balancer7 (C25_7.2 R40_7.2), U_BMS/balancer8 (C25_8.1 R45_8.2 R47_8.2)
+BalanceCommand_8: BMS (U2.8), U_BMS/balancer8 (C25_8.2 R40_8.2), U_BMS/balancer9 (C25_9.1 R45_9.2 R47_9.2)
+BalanceCommand_9: BMS (U2.7), U_BMS/balancer9 (C25_9.2 R40_9.2), U_BMS/balancer10 (C25_10.1 R45_10.2 R47_10.2)
+BalanceCommand_10: BMS (U2.6), U_BMS/balancer10 (C25_10.2 R40_10.2), U_BMS/balancer11 (C25_11.1 R45_11.2 R47_11.2)
+BalanceCommand_11: BMS (U2.5), U_BMS/balancer11 (C25_11.2 R40_11.2), U_BMS/balancer12 (C25_12.1 R45_12.2 R47_12.2)
+BalanceCommand_12: BMS (U2.4), U_BMS/balancer12 (C25_12.2 R40_12.2), U_BMS/balancer13 (C25_13.1 R45_13.2 R47_13.2)
+BalanceCommand_13: BMS (U2.3), U_BMS/balancer13 (C25_13.2 R40_13.2), U_BMS/balancer14 (C25_14.1 R45_14.2 R47_14.2)
+BalanceCommand_14: BMS (U2.2), U_BMS/balancer14 (C25_14.2 R40_14.2), U_BMS/balancer15 (C25_15.1 R45_15.2 R47_15.2)
+BalanceCommand_15: BMS (U2.1), U_BMS/balancer15 (C25_15.2 R40_15.2), U_BMS/balancer16 (C25_16.1 R45_16.2 R47_16.2)
+BalanceCommand_16: BMS (R65.1 U2.48), U_BMS/balancer16 (C25_16.2 R40_16.2)
+Cell_1: BMS (J1.31 J3.2), U_BMS/balancer1 (5 pins), U_BMS/balancer2 (Q2_2.3 R46_2.1 R47_2.1)
+Cell_2: BMS (J1.29 J3.3), U_BMS/balancer2 (5 pins), U_BMS/balancer3 (Q2_3.3 R46_3.1 R47_3.1)
+Cell_3: BMS (J1.27 J3.4), U_BMS/balancer3 (5 pins), U_BMS/balancer4 (Q2_4.3 R46_4.1 R47_4.1)
+Cell_4: BMS (J1.25 J3.5), U_BMS/balancer4 (5 pins), U_BMS/balancer5 (Q2_5.3 R46_5.1 R47_5.1)
+Cell_5: BMS (J1.23 J3.6), U_BMS/balancer5 (5 pins), U_BMS/balancer6 (Q2_6.3 R46_6.1 R47_6.1)
+Cell_6: BMS (J1.21 J3.7), U_BMS/balancer6 (5 pins), U_BMS/balancer7 (Q2_7.3 R46_7.1 R47_7.1)
+Cell_7: BMS (J1.19 J3.8), U_BMS/balancer7 (5 pins), U_BMS/balancer8 (Q2_8.3 R46_8.1 R47_8.1)
+Cell_8: BMS (J1.17 J3.9), U_BMS/balancer8 (5 pins), U_BMS/balancer9 (Q2_9.3 R46_9.1 R47_9.1)
+Cell_9: BMS (J1.15 J3.10), U_BMS/balancer9 (5 pins), U_BMS/balancer10 (Q2_10.3 R46_10.1 R47_10.1)
+Cell_10: BMS (J1.13 J2.1), U_BMS/balancer10 (5 pins), U_BMS/balancer11 (Q2_11.3 R46_11.1 R47_11.1)
+Cell_11: BMS (J1.11 J2.2), U_BMS/balancer11 (5 pins), U_BMS/balancer12 (Q2_12.3 R46_12.1 R47_12.1)
+Cell_12: BMS (J1.9 J2.3), U_BMS/balancer12 (5 pins), U_BMS/balancer13 (Q2_13.3 R46_13.1 R47_13.1)
+Cell_13: BMS (J1.7 J2.4), U_BMS/balancer13 (5 pins), U_BMS/balancer14 (Q2_14.3 R46_14.1 R47_14.1)
+Cell_14: BMS (J1.5 J2.5), U_BMS/balancer14 (5 pins), U_BMS/balancer15 (Q2_15.3 R46_15.1 R47_15.1)
+Cell_15: BMS (J1.3 J2.6), U_BMS/balancer15 (5 pins), U_BMS/balancer16 (Q2_16.3 R46_16.1 R47_16.1)
-BalanceCommand_1: BMS (U2.16), U_BMS/balancer1 (C25_1.1 R45_1.2 R47_1.2)
-Cell_1: BMS (J3.1 NT1.1 R27.1), U_BMS/balancer1 (Q2_1.3 R46_1.1 R47_1.1)
CAN_RX: MCU (U1.44), Communication (R48.2 U5.2)
CAN_TX: MCU (U1.45), Communication (R36.2 U5.3)
NetPB1_1: MCU (U1.29), BMS (PB1.1 R38.2 R39.1)
NetR9_2: MCU (R9.2 U1.56), BMS (R64.1 U2.27)
NetR10_2: MCU (R10.2 U1.55), BMS (R70.1 U2.26)
NetU1_28: MCU (U1.28), BMS (U2.25)
NetU1_57: MCU (U1.57), BMS (U2.28)
NetU1_61: MCU (U1.61), BMS (U2.29)
RS_TR_EN: MCU (U1.41), Communication (R58.1 U6.4 U6.5)
TS_1: MCU (U1.14), TS1 (R55_1.1 TS_1.1)
TS_2: MCU (U1.15), TS2 (R55_2.1 TS_2.1)
TS_3: MCU (U1.16), TS3 (R55_3.1 TS_3.1)
TS_4: MCU (U1.17), TS4 (R55_4.1 TS_4.1)
TS_5: MCU (U1.20), TS5 (R55_5.1 TS_5.1)
TS_6: MCU (U1.21), TS6 (R55_6.1 TS_6.1)
TS_7: MCU (U1.22), TS7 (R55_7.1 TS_7.1)
TS_8: MCU (U1.23), TS8 (R55_8.1 TS_8.1)
TS_9: MCU (U1.26), TS9 (R55_9.1 TS_9.1)
TS_10: MCU (U1.27), TS10 (R55_10.1 TS_10.1)
TS_11: MCU (U1.8), TS11 (R55_11.1 TS_11.1)
TS_12: MCU (U1.9), TS12 (R55_12.1 TS_12.1)
TS_13: MCU (U1.10), TS13 (R55_13.1 TS_13.1)
TS_14: MCU (U1.11), TS14 (R55_14.1 TS_14.1)
TS_15: MCU (U1.24), TS15 (R55_15.1 TS_15.1)
TS_16: MCU (U1.25), TS16 (R55_16.1 TS_16.1)
TS_17: BMS (U2.21), TS17 (R55_17.1 TS_17.1)
TS_18: BMS (U2.22), TS18 (R55_18.1 TS_18.1)
TS_19: BMS (U2.23), TS19 (R55_19.1 TS_19.1)
TS_20: BMS (U2.32), TS20 (R55_20.1 TS_20.1)
TS_21: BMS (U2.31), TS21 (R55_21.1 TS_21.1)
TS_22: BMS (U2.30), TS22 (R55_22.1 TS_22.1)
USART1_RX: MCU (U1.43), Communication (U6.3)
USART1_TX: MCU (U1.42), Communication (U6.6)